# EasyEDA Pro project 主控板_V1.eprj

# Schematic 主控板
Create Date: 2023-10-18; Page Name: P1; Project Name: 主控板_V1. - 副本; Schematic Name: 主控板; Update Date: 2023-11-02; Company: 嘉立创EDA; Page Size: A4; Version: V1.0
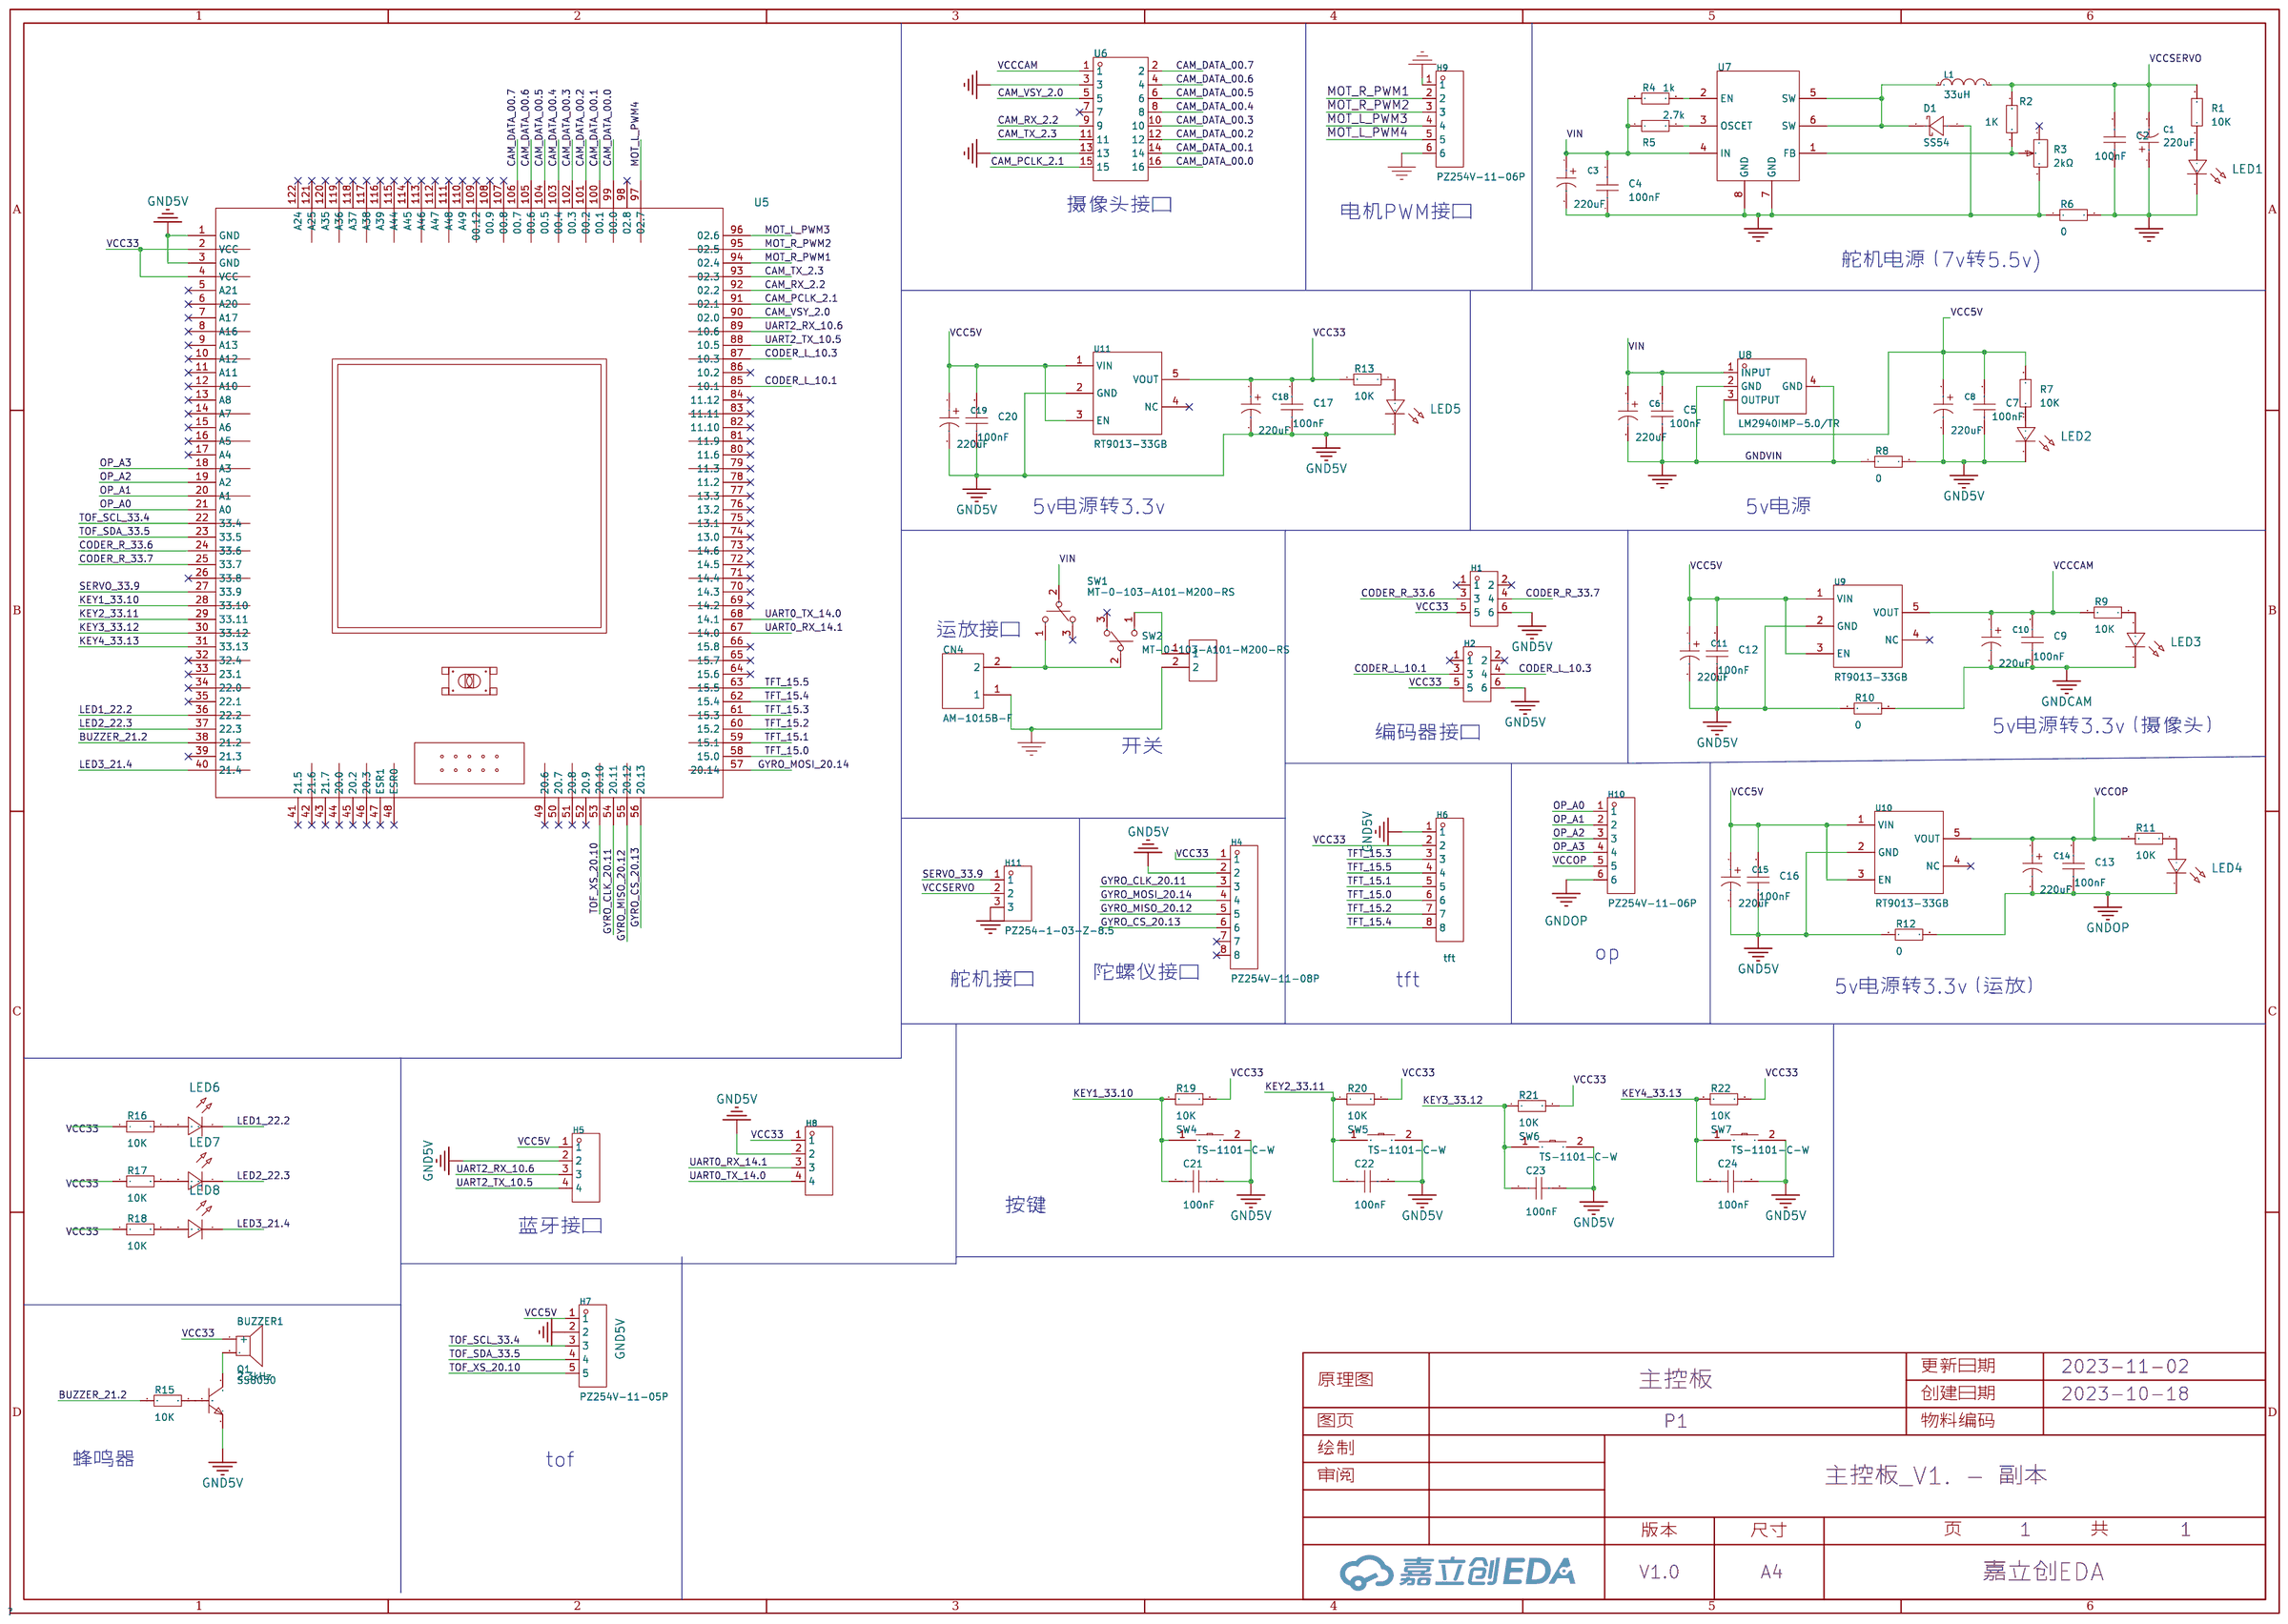
[diagram p0: schematic sheet]

## Parts
BUZZER1  2.3kHz  [BUZ-TH_BD12.0-P7.60-D0.6-FD]
C1  220uF  [CAP-SMD_BD6.3-L6.6-W6.6-FD]
C2  100nF  [C0603]
C3  220uF  [CAP-SMD_BD6.3-L6.6-W6.6-FD]
C4  100nF  [C0603]
C5  100nF  [C0603]
C6  220uF  [CAP-SMD_BD6.3-L6.6-W6.6-FD]
C7  100nF  [C0603]
C8  220uF  [CAP-SMD_BD6.3-L6.6-W6.6-FD]
C9  100nF  [C0603]
C10  220uF  [CAP-SMD_BD6.3-L6.6-W6.6-FD]
C11  220uF  [CAP-SMD_BD6.3-L6.6-W6.6-FD]
C12  100nF  [C0603]
C13  100nF  [C0603]
C14  220uF  [CAP-SMD_BD6.3-L6.6-W6.6-FD]
C15  220uF  [CAP-SMD_BD6.3-L6.6-W6.6-FD]
C16  100nF  [C0603]
C17  100nF  [C0603]
C18  220uF  [CAP-SMD_BD6.3-L6.6-W6.6-FD]
C19  220uF  [CAP-SMD_BD6.3-L6.6-W6.6-FD]
C20  100nF  [C0603]
C21  100nF  [C0603]
C22  100nF  [C0603]
C23  100nF  [C0603]
C24  100nF  [C0603]
CN4  AM-1015B-F  [CONN-TH_AM-1015B-F]
D1  SS54  [SMA_L4.3-W2.6-LS5.0-FD]
H1  PZ254V-12-6P  [HDR-TH_6P-P2.54-V-M-R2-C3-S2.54]
H2  PZ254V-12-6P  [HDR-TH_6P-P2.54-V-M-R2-C3-S2.54]
H4  PZ254V-11-08P  [HDR-TH_8P-P2.54-V-M]
H5  PZ254V-11-04P  [HDR-TH_4P-P2.54-V-M]
H6  tft  [HDR-TH_8P-P2.54-V-M]
H7  PZ254V-11-05P  [HDR-TH_5P-P2.54-V-M]
H8  PZ254V-11-04P  [HDR-TH_4P-P2.54-V-M]
H9  PZ254V-11-06P  [HDR-TH_6P-P2.54-V-M]
H10  PZ254V-11-06P  [HDR-TH_6P-P2.54-V-M]
H11  PZ254-1-03-Z-8.5  [HDR-TH_03P-P2.54-V-M]
L1  33uH  [IND-SMD_L7.0-W6.6_FXL0630]
LED1  -  [LED_0603]
LED2  -  [LED_0603]
LED3  -  [LED_0603]
LED4  -  [LED_0603]
LED5  -  [LED_0603]
LED6  -  [LED_0603]
LED7  -  [LED_0603]
LED8  -  [LED_0603]
P1  WJ500V-5.08-2P  [CONN-TH_2P-P5.00_WJ500V-5.08-2P]
Q1  SS8050  [SOT-23-3_L2.9-W1.3-P1.90-LS2.4-BR]
R1  10K  [R0603]
R2  1K  [R0603]
R3  2kΩ  [RES-ADJ-TH_3296W]
R4  1k  [R0603]
R5  2.7k  [R0603]
R6  0  [R0805]
R7  10K  [R0603]
R8  0  [R0805]
R9  10K  [R0603]
R10  0  [R0805]
R11  10K  [R0603]
R12  0  [R0805]
R13  10K  [R0603]
R15  10K  [R0603]
R16  10K  [R0603]
R17  10K  [R0603]
R18  10K  [R0603]
R19  10K  [R0603]
R20  10K  [R0603]
R21  10K  [R0603]
R22  10K  [R0603]
SW1  MT-0-103-A101-M200-RS  [SW-TH_MT-0-103-A101-M200-RS]
SW2  MT-0-103-A101-M200-RS  [SW-TH_MT-0-103-A101-M200-RS]
SW4  TS-1101-C-W  [SW-SMD_L6.0-W3.3-LS8.0]
SW5  TS-1101-C-W  [SW-SMD_L6.0-W3.3-LS8.0]
SW6  TS-1101-C-W  [SW-SMD_L6.0-W3.3-LS8.0]
SW7  TS-1101-C-W  [SW-SMD_L6.0-W3.3-LS8.0]
U5  TC264_CoreBoard  [TC264_main]
U6  PM254-2-08-Z-8.5  [HDR-TH_16P-P2.54-V-F-R2-C8-S2.54]
U7  -  [AS1015]
U8  LM2940IMP-5.0/TR  [SOT-223-3_L6.5-W3.4-P2.30-LS7.0-BR]
U9  RT9013-33GB  [SOT-23-5_L3.0-W1.7-P0.95-LS2.8-BL]
U10  RT9013-33GB  [SOT-23-5_L3.0-W1.7-P0.95-LS2.8-BL]
U11  RT9013-33GB  [SOT-23-5_L3.0-W1.7-P0.95-LS2.8-BL]

## Library data of the parts
BUZZER1 = TMB12A05_C96093: 驱动方式:有源(内含驱动线路);构造类型:电磁式;额定电压:5V;频率:2.3kHz;声压(SPL):85dB@5V,10cm;; LCSC Part Name: TMB12A05; Supplier Part: C96093; Manufacturer: 华能; Manufacturer Part: TMB12A05; Supplier Footprint: 插件,D=12mm; JLCPCB Part Class: Extended Part; Datasheet: https://atta.szlcsc.com/upload/public/pdf/source/20170522/1495448324811.pdf; Supplier: LCSC; Oscillator Circuit: 有源(内含驱动线路); Technology Type: 电磁式; Rated Voltage: 5V; Operating Voltage: 4V~8V; Sound Pressure Level (SPL): 85dB@5V,10cm; Diameter (φD): 12mm; Height: 9.8mm
C1 C3 C6 C8 C10 C11 C14 C15 C18 C19 = RVT220UF16V67RV0015: 容值:220uF;精度:±20%;额定电压:16V;纹波电流:110mA@120Hz;等效串联电阻:-;; LCSC Part Name: 220uF ±20% 16V; Supplier Part: C2887273; Manufacturer: KNSCHA(科尼盛); Supplier Footprint: SMD,D6.3xL7.7mm; JLCPCB Part Class: Extended Part; Datasheet: https://atta.szlcsc.com/upload/public/pdf/source/20210824/3DC9999D9B098FE241E3A26137981C4C.pdf; Supplier: LCSC; Tolerance: ±20%; Rated Voltage: 16V; φD: 6.3mm; L: 7.7mm; Ripple Current: 110mA@120Hz; Lifetime @ Temp: 2000hrs@105℃; Operating Temperature: -55℃~+105℃
C2 C4 C5 C7 C9 C12 C13 C16 C17 C20-C24 = CAP_0603: Supplier Footprint: 0603
CN4 = AM-1015B-F: 金属材质：铜镀金  绝缘材质：PA; LCSC Part Name: AMASS(艾迈斯) 防滑T插T型插头紫红大电流航空连接器AM-1015B-F; Supplier Part: C90630; Manufacturer: AMASS(艾迈斯); JLCPCB Part Class: Extended Part; Datasheet: https://atta.szlcsc.com/upload/public/pdf/source/20161217/1481939174479.pdf; Supplier: LCSC
D1 = SS54_C7420369: 二极管配置:独立式;直流反向耐压(Vr):40V;平均整流电流(Io):5A;正向压降(Vf):550mV@5.0A;; LCSC Part Name: 电压:40V 电流:5A; Supplier Part: C7420369; Manufacturer: 宏迦橙; Supplier Footprint: SMA; JLCPCB Part Class: Extended Part; Datasheet: https://atta.szlcsc.com/upload/public/pdf/source/20230828/254C3882F8647358AD9F60DD73611B5E.pdf; Supplier: LCSC; Diode Configuration: 独立式; Reverse Voltage (Vr): 40V; Average Rectified Current (Io): 5A; Forward Voltage (Vf@If): 550mV@5.0A; Reverse Leakage Current (Ir): 50uA@40V; Peak forward surge current: 120A
H1 H2 = PZ254V-12-6P: 排数:双排;总PIN位数:6P;间距:2.54mm;插针结构:2x3P;行距:2.54mm;安装类型:直插;圆针/方针:方针;额定电流:-;额定电压:-;配合针长度:6mm;塑高:2.5mm;端接针长度:3mm;触头材质:黄铜;触头镀层:-;工作温度范围:-40℃~+105℃;颜色:黑色;; LCSC Part Name: 2.54mm 2x3P 直插 方针; Supplier Part: C492420; Manufacturer: XFCN(兴飞); Supplier Footprint: 插件,P=2.54mm; JLCPCB Part Class: 扩展库; Datasheet: https://atta.szlcsc.com/upload/public/pdf/source/20200309/C492420_BAECB307B001054C09D200388220EAE6.pdf; Supplier: LCSC; Number of Rows: 双排; Number of Pins: 6P; Pitch: 2.54mm; Pin Structure: 2x3P; Row Spacing: 2.54mm; Mounting Type: 直插; Circluar Pins/Square Pins: 方针; Length of Mating Pin: 6mm; Insulation Height: 2.5mm; Length of End Connection Pin: 3mm; Contact Material: 黄铜; Operating Temperature Range: -40℃~+105℃; Color: 黑色
H4 H6 = PZ254V-11-08P: 排数:单排;总PIN位数:8P;间距:2.54mm;插针结构:1x8P;行距:-;安装类型:直插;圆针/方针:方针;额定电流:-;额定电压:-;配合针长度:6mm;塑高:2.5mm;端接针长度:3mm;触头材质:黄铜;触头镀层:-;工作温度范围:-40℃~+105℃;颜色:黑色;; LCSC Part Name: 2.54mm 1x8P 直插 方针; Supplier Part: C492407; Manufacturer: XFCN(兴飞); Supplier Footprint: 插件,P=2.54mm; JLCPCB Part Class: 扩展库; Datasheet: https://atta.szlcsc.com/upload/public/pdf/source/20200309/C492407_83A6FB26A2233368EDB9516968EC6149.pdf; Supplier: LCSC; Number of Rows: 单排; Number of Pins: 8P; Pitch: 2.54mm; Pin Structure: 1x8P; Mounting Type: 直插; Circluar Pins/Square Pins: 方针; Length of Mating Pin: 6mm; Insulation Height: 2.5mm; Length of End Connection Pin: 3mm; Contact Material: 黄铜; Operating Temperature Range: -40℃~+105℃; Color: 黑色
H5 H8 = PZ254V-11-04P: 排数:单排;总PIN位数:4P;间距:2.54mm;插针结构:1x4P;行距:-;安装类型:直插;圆针/方针:方针;额定电流:3A;额定电压:250V;配合针长度:6mm;塑高:2.5mm;端接针长度:3mm;触头材质:-;工作温度范围:-40℃~+105℃;颜色:黑色;; LCSC Part Name: 2.54mm 1x4P 直插 方针; Supplier Part: C2691448; Manufacturer: XFCN(兴飞); Supplier Footprint: 插件,P=2.54mm; JLCPCB Part Class: Extended Part; Datasheet: https://atta.szlcsc.com/upload/public/pdf/source/20200309/C492403_F9F19131791D08044AD4F84F8E751A34.pdf; Supplier: LCSC; Number of Rows: 单排; Number of Pins: 4P; Pitch: 2.54mm; Pin Structure: 1x4P; Mounting Type: 直插; Circluar Pins/Square Pins: 方针; Current Rating (Max): 3A; Voltage Rating (Max): 250V; Length of Mating Pin: 6mm; Insulation Height: 2.5mm; Length of End Connection Pin: 3mm; Operating Temperature Range: -40℃~+105℃; Color: 黑色
H7 = PZ254V-11-05P: 排数:单排;总PIN位数:5P;间距:2.54mm;插针结构:1x5P;行距:-;安装类型:直插;圆针/方针:方针;额定电流:-;额定电压:-;配合针长度:6mm;塑高:2.5mm;端接针长度:3mm;触头材质:黄铜;触头镀层:-;工作温度范围:-40℃~+105℃;颜色:黑色;; LCSC Part Name: 2.54mm 1x5P 直插 方针; Supplier Part: C492404; Manufacturer: XFCN(兴飞); Supplier Footprint: 插件,P=2.54mm; JLCPCB Part Class: 扩展库; Datasheet: https://atta.szlcsc.com/upload/public/pdf/source/20200309/C492404_E51533260F8710EFF5D4617281164C1D.pdf; Supplier: LCSC; Number of Rows: 单排; Number of Pins: 5P; Pitch: 2.54mm; Pin Structure: 1x5P; Mounting Type: 直插; Circluar Pins/Square Pins: 方针; Length of Mating Pin: 6mm; Insulation Height: 2.5mm; Length of End Connection Pin: 3mm; Contact Material: 黄铜; Operating Temperature Range: -40℃~+105℃; Color: 黑色
H9 H10 = PZ254V-11-06P: 排数:单排;总PIN位数:6;间距:2.54mm;插针结构:1x6P;行距:-;安装类型:直插;圆针/方针:方针;额定电流:-;额定电压:-;配合针长度:6mm;塑高:2.5mm;端接针长度:3mm;触头材质:黄铜;触头镀层:-;工作温度范围:-40℃~+105℃;颜色:黑色;; LCSC Part Name: 2.54mm 1x6P 直插 方针; Supplier Part: C492405; Manufacturer: XFCN(兴飞); Supplier Footprint: 直插,P=2.54mm; JLCPCB Part Class: 扩展库; Supplier: LCSC; Number of Rows: 单排; Number of Pins: 6; Pitch: 2.54mm; Pin Structure: 1x6P; Mounting Type: 直插; Circluar Pins/Square Pins: 方针; Length of Mating Pin: 6mm; Insulation Height: 2.5mm; Length of End Connection Pin: 3mm; Contact Material: 黄铜; Operating Temperature Range: -40℃~+105℃; Color: 黑色
H11 = PZ254-1-03-Z-8.5: 排数:单排;总PIN位数:3P;间距:2.54mm;插针结构:1x3P;行距:-;安装类型:直插;圆针/方针:方针;额定电流:3A;额定电压:-;配合针长度:6mm;塑高:2.5mm;端接针长度:3mm;触头材质:-;工作温度范围:-40℃~+105℃;颜色:黑色;; LCSC Part Name: 2.54mm 1x3P 直插 方针; Supplier Part: C2894926; Manufacturer: HCTL(华灿天禄); Supplier Footprint: 插件,P=2.54mm; JLCPCB Part Class: Extended Part; Datasheet: https://atta.szlcsc.com/upload/public/pdf/source/20230609/805D25CEF03592837AF6F506EEB5ED41.pdf; Supplier: LCSC; Number of Rows: 单排; Number of Pins: 3P; Pitch: 2.54mm; Pin Structure: 1x3P; Mounting Type: 直插; Circluar Pins/Square Pins: 方针; Current Rating (Max): 3A; Length of Mating Pin: 6mm; Insulation Height: 2.5mm; Length of End Connection Pin: 3mm; Operating Temperature Range: -40℃~+105℃; Color: 黑色
L1 = FXL0630-330-M: 类型:一体成型电感;电感值:33uH;精度:±20%;额定电流:2A;饱和电流(Isat):2.5A;; LCSC Part Name: 33uH ±20% 2.5A; Supplier Part: C177245; Manufacturer: cjiang(长江微电); Supplier Footprint: SMD,6.6x7mm; JLCPCB Part Class: 扩展库; Datasheet: https://atta.szlcsc.com/upload/public/pdf/source/20230516/3A080F5AF8C87BB81C3BA86E5F60E51A.pdf; Supplier: LCSC; Type: 一体成型电感; Tolerance: ±20%; Rated Current: 2A; Saturation Current (Isat): 2.5A; DC Resistance (DCR): 310mΩ
LED1-LED8 = LED_0603-R: Supplier Footprint: 0603
P1 = WJ500V-5.08-2P: 间距:5.08mm;结构:1x2P;排数:1;每排PIN数:2;安装方式:直针;额定电流:18A;额定电压:250V;线规 - AWG:14~30;线规 - mm2:2.5;工作温度范围:-40℃~+105℃;颜色:绿色;; LCSC Part Name: 5.08mm 1x2P 排数:1 每排P数:2 直针 可拼接; Supplier Part: C8465; Manufacturer: KANGNEX(康奈克斯电气); Supplier Footprint: 插件,P=5.08mm; JLCPCB Part Class: 扩展库; Datasheet: https://atta.szlcsc.com/upload/public/pdf/source/20191225/C8465_02D34CE5B5B4A53DF5891601D97FA9F4.pdf; Supplier: LCSC; Pitch: 5.08mm; Structure: 1x2P; Number of Rows: 1; Number of PINs Per Row: 2; Mounting Style: 直针; Current Rating (Max): 18A; Voltage Rating (Max): 250V; Wire Gauge - AWG: 14~30; Wire Gauge - mm2: 2.5; Operating Temperature Range: -40℃~+105℃; Color: 绿色
Q1 = SS8050_C2150: 晶体管类型:NPN;集射极击穿电压(Vceo):25V;集电极电流(Ic):1.5A;功率(Pd):300mW;直流电流增益(hFE@Ic,Vce):200@100mA,1V;; LCSC Part Name: NPN 25V 1.5A Y1 200-350; Supplier Part: C2150; Manufacturer: CJ(江苏长电/长晶); Supplier Footprint: SOT-23; JLCPCB Part Class: Basic Part; Datasheet: https://atta.szlcsc.com/upload/public/pdf/source/20230322/AEE86F4B043774EFF80CAEA14A37D9E9.pdf; Supplier: LCSC; Transistor Type: NPN; Collector-Emitter Breakdown Voltage (Vceo): 25V; Collector Current (Ic): 1.5A; Power Dissipation (Pd): 300mW; Collector Cut-Off Current (Icbo): 100nA; Collector-Emitter Saturation Voltage (VCE(sat)@Ic,Ib): 500mV@800mA,80mA; DC Current Gain (hFE@Ic,Vce): 200@100mA,1V; Transition Frequency (fT): 100MHz; Operating Temperature: +150℃@(Tj)
R1 R2 R4 R5 R7 R9 R11 R13 R15-R22 = Res_0603: Supplier Footprint: 0603
R3 = 3296W-1-102LF: 阻值:1kΩ;精度:±10%;功率:500mW;; LCSC Part Name: 1kΩ ±10%; Supplier Part: C57089; Manufacturer: BOURNS; Supplier Footprint: 插件; JLCPCB Part Class: 扩展库; Datasheet: https://atta.szlcsc.com/upload/public/pdf/source/20151026/1457707506403.pdf; Supplier: LCSC; Tolerance: ±10%; Power(Watts): 500mW; Temperature Coefficient: ±100ppm/℃; Turns: 25
R6 R8 R10 R12 = Res_0805: Supplier Footprint: 0805
SW1 SW2 = MT-0-103-A101-M200-RS: 额定电流:5A;额定电压(AC):125V;电路结构:单刀双掷;机械寿命:-;安装方式:直插;; LCSC Part Name: 小型钮子三脚三档 五件套 含配件; Supplier Part: C1788493; Manufacturer: YUEN FUNG(源丰); Supplier Footprint: 插件; JLCPCB Part Class: Extended Part; Datasheet: https://atta.szlcsc.com/upload/public/pdf/source/20230720/A7297B66510B798CA716A50870BE0E5B.pdf; Supplier: LCSC; Contact Current: 5A; Voltage Rating (AC): 125V; Circuit: 单刀双掷; Actuator Type: 圆柱钮柄; Pin Style: 焊片; Mounting Style: 直插; Operating Temperature: -25℃~+85℃; Switch Length: 13mm; Switch Width: 8mm; Switch Height: 28.6mm
SW4-SW7 = TS-1101-C-W: 触点电流:50mA;额定电压(AC):-;额定电压(DC):12V;额定功率:-;绝缘电阻:-;电路结构:单刀单掷;安装方式:立贴;带灯:无;作用力:260gf;机械寿命:5万次;带支架:否;; LCSC Part Name: 立贴 6*3.6*2.5mm 轻触开关 一型3*6*2.5有白ZD b拉伸白色带淡绿按键 卷装; Supplier Part: C318938; Manufacturer: XKB Connectivity(中国星坤); Supplier Footprint: SMD; JLCPCB Part Class: Extended Part; Datasheet: https://atta.szlcsc.com/upload/public/pdf/source/20200227/C318938_C2E53B1EEDE37D980A33616AC086DE53.pdf; Supplier: LCSC; Contact Current: 50mA; Voltage Rating (DC): 12V; Circuit: 单刀单掷; Mounting Style: 立贴; Actuator Style: 矩形按钮; Actuator/Cap Color: 白色带淡绿; With Lamp: 无; Operating Force: 260gf; Mechanical Life: 5万次; Operating Temperature: -30℃~+85℃; Switch Length: 6mm; Switch Width: 3.6mm; Switch Height: 2.5mm; Strike Gundam: 否
U5 = TC264_CoreBoard: TC264核心板
U6 = PM254-2-08-Z-8.5: 排数:双排;总孔位数:16P;间距:2.54mm;插孔结构:2x8P;行距:2.54mm;安装类型:直插;圆孔/方孔:方孔;额定电流:3A;额定电压:-;插孔方向:顶部;塑高:8.5mm;工作温度范围:-40℃~+105℃;; LCSC Part Name: 间距:2.54mm 2x8P 直插; Supplier Part: C2897409; Manufacturer: HCTL(华灿天禄); Supplier Footprint: 插件,P=2.54mm; JLCPCB Part Class: 扩展库; Datasheet: https://atta.szlcsc.com/upload/public/pdf/source/20230609/3D36CA2C1BFC9FD1C3F709AD9DFEB9C2.pdf; Supplier: LCSC; Number of Rows: 双排; Number of Holes: 16P; Pitch: 2.54mm; Holes Structure: 2x8P; Row Spacing: 2.54mm; Mounting Type: 直插; Circular Hole / Square Hole: 方孔; Current Rating (Max): 3A; Holes Direction: 顶部; Insulation Height: 8.5mm; Operating Temperature Range: -40℃~+105℃
U7 = aaa
U8 = LM2940IMP-5.0/TR: 输出类型:-;; Supplier Part: C565359; Manufacturer: HGSEMI(华冠); Supplier Footprint: SOT-223-3L; JLCPCB Part Class: 扩展库; Datasheet: https://atta.szlcsc.com/upload/public/pdf/source/20200910/C434496_FF12BC19E49A5882ABC2C07A121F415A.pdf; Supplier: LCSC
U9-U11 = RT9013-33GB: 输出类型:固定;输出极性:正;最大输入电压:5.5V;输出电压:3.3V;输出电流:500mA;电源纹波抑制比(PSRR):50dB@(10kHz);; LCSC Part Name: 输入5.5V 输出3.3V 500mA; Supplier Part: C47773; Manufacturer: RICHTEK(立锜); Supplier Footprint: SOT-23-5; JLCPCB Part Class: 扩展库; Datasheet: https://atta.szlcsc.com/upload/public/pdf/source/20150504/1457707282459.pdf; Supplier: LCSC; Output Type: 固定; Output Polarity: 正; Number of Outputs: 1; Maximum Input Voltage: 5.5V; Output Voltage: 3.3V; Dropout Voltage: 400mV@(500mA); Quiescent Current (Ground Current): 50uA; Output Current: 500mA; Power Supply Rejection Ratio (PSRR): 50dB@(10kHz); Operating Temperature: -40℃~+85℃

## Nets
GND5V: C7.1 C8.2 C11.2 C12.1 C15.2 C16.1 C17.1 C18.2 C19.2 C20.1 C21.2 C22.2 C23.2 C24.2 H1.6 H2.6 H4.2 H5.2 H6.1 H7.2 H8.2 LED2.1(C) LED5.1(C) Q1.2(E) R8.2 R10.1 R12.1 SW4.2 SW5.2 SW6.2 SW7.2 U5.1(GND) U5.3(GND) U9.2(GND) U10.2(GND) U11.2(GND)
GNDCAM: C9.1 C10.2 LED3.1(C) R10.2 U6.3 U6.13
GNDOP: C13.1 C14.2 H10.6 LED4.1(C) R12.2
GNDSERVO: C1.1 C2.1 H11.3 LED1.1(C) R6.2
GNDVIN: C3.2 C4.1 C5.1 C6.2 CN4.1 D1.1(A) H9.1 H9.6 P1.2 R3.3 R6.1 R8.1 U7.7(GND) U7.8(GND) U8.2(GND) U8.4(GND)
VCC5V: C7.2 C8.1 C11.1 C12.2 C15.1 C16.2 C19.1 C20.2 H5.1 H7.1 R7.2 U8.3(OUTPUT) U9.1(VIN) U9.3(EN) U10.1(VIN) U10.3(EN) U11.1(VIN) U11.3(EN)
VCC33: BUZZER1.1(+) C17.2 C18.1 H1.5 H2.5 H4.1 H6.2 H8.1 R13.2 R16.1 R17.1 R18.1 R19.2 R20.2 R21.2 R22.2 U5.2(VCC) U5.4(VCC) U11.5(VOUT)
VCCCAM: C9.2 C10.1 R9.2 U6.1 U9.5(VOUT)
VCCOP: C13.2 C14.1 H10.5 R11.2 U10.5(VOUT)
VCCSERVO: C1.2 C2.2 H11.2 L1.2 R1.2 R2.2
VIN: C3.1 C4.2 C5.2 C6.1 R4.1 R5.1 SW1.2 U7.4(IN) U8.1(INPUT)
BUZZER_21.2: R15.2 U5.38(21.2)
CAM_DATA_00.0: U5.99(00.0) U6.16
CAM_DATA_00.1: U5.100(00.1) U6.14
CAM_DATA_00.2: U5.101(00.2) U6.12
CAM_DATA_00.3: U5.102(00.3) U6.10
CAM_DATA_00.4: U5.103(00.4) U6.8
CAM_DATA_00.5: U5.104(00.5) U6.6
CAM_DATA_00.6: U5.105(00.6) U6.4
CAM_DATA_00.7: U5.106(00.7) U6.2
CAM_PCLK_2.1: U5.91(02.1) U6.15
CAM_RX_2.2: U5.92(02.2) U6.9
CAM_TX_2.3: U5.93(02.3) U6.11
CAM_VSY_2.0: U5.90(02.0) U6.5
CODER_L_10.1: H2.3 U5.85(10.1)
CODER_L_10.3: H2.4 U5.87(10.3)
CODER_R_33.6: H1.3 U5.24(33.6)
CODER_R_33.7: H1.4 U5.25(33.7)
GYRO_CLK_20.11: H4.3 U5.54(20.11)
GYRO_CS_20.13: H4.6 U5.56(20.13)
GYRO_MISO_20.12: H4.5 U5.55(20.12)
GYRO_MOSI_20.14: H4.4 U5.57(20.14)
KEY1_33.10: C21.1 R19.1 SW4.1 U5.28(33.10)
KEY2_33.11: C22.1 R20.1 SW5.1 U5.29(33.11)
KEY3_33.12: C23.1 R21.1 SW6.1 U5.30(33.12)
KEY4_33.13: C24.1 R22.1 SW7.1 U5.31(33.13)
LED1_22.2: LED6.1(C) U5.36(22.2)
LED2_22.3: LED7.1(C) U5.37(22.3)
LED3_21.4: LED8.1(C) U5.40(21.4)
MOT_L_PWM3: H9.4 U5.96(02.6)
MOT_L_PWM4: H9.5 U5.97(02.7)
MOT_R_PWM1: H9.2 U5.94(02.4)
MOT_R_PWM2: H9.3 U5.95(02.5)
OP_A0: H10.1 U5.21(A0)
OP_A1: H10.2 U5.20(A1)
OP_A2: H10.3 U5.19(A2)
OP_A3: H10.4 U5.18(A3)
SERVO_33.9: H11.1 U5.27(33.9)
TFT_15.0: H6.6 U5.58(15.0)
TFT_15.1: H6.5 U5.59(15.1)
TFT_15.2: H6.7 U5.60(15.2)
TFT_15.3: H6.3 U5.61(15.3)
TFT_15.4: H6.8 U5.62(15.4)
TFT_15.5: H6.4 U5.63(15.5)
TOF_SCL_33.4: H7.3 U5.22(33.4)
TOF_SDA_33.5: H7.4 U5.23(33.5)
TOF_XS_20.10: H7.5 U5.53(20.10)
UART0_RX_14.1: H8.3 U5.67(14.0)
UART0_TX_14.0: H8.4 U5.68(14.1)
UART2_RX_10.6: H5.3 U5.89(10.6)
UART2_TX_10.5: H5.4 U5.88(10.5)
$1N1136: D1.2(K) L1.1 U7.5(SW) U7.6(SW)
$1N1293: LED1.2(A) R1.1
$1N1648: R2.1 R3.2 U7.1(FB)
$1N1993: R4.2 U7.2(EN)
$1N1996: R5.2 U7.3(OSCET)
$1N2771: LED2.2(A) R7.1
$1N3451: LED3.2(A) R9.1
$1N4006: LED4.2(A) R11.1
$1N4319: LED5.2(A) R13.1
$1N4945: CN4.2 SW1.1 SW2.2
$1N4946: P1.1 SW2.1
$1N5921: BUZZER1.2 Q1.3(C)
$1N6046: Q1.1(B) R15.1
$1N7737: LED6.2(A) R16.2
$1N7792: LED7.2(A) R17.2
$1N7846: LED8.2(A) R18.2

Not connected (* = marked no-connect by the designer): H1 1* 2*; H2 1* 2*; H4 7* 8*; R3 1*; SW1 3*; SW2 3*; U5 5(A21)* 6(A20)* 7(A17)* 8(A16)* 9(A13)* 10(A12)* 11(A11)* 12(A10)* 13(A8)* 14(A7)* 15(A6)* 16(A5)* 17(A4)* 26(33.8)* 32(32.4)* 33(23.1)* 34(22.0)* 35(22.1)* 39(21.3)* 41(21.5)* 42(21.6)* 43(21.7)* 44(20.0)* 45(20.2)* 46(20.3)* 47(ESR1)* 48(ESR0)* 49(20.6)* 50(20.7)* 51(20.8)* 52(20.9)* 64(15.6)* 65(15.7)* 66(15.8)* 69(14.2)* 70(14.3)* 71(14.4)* 72(14.5)* 73(14.6)* 74(13.0)* 75(13.1)* 76(13.2)* 77(13.3)* 78(11.2)* 79(11.3)* 80(11.6)* 81(11.9)* 82(11.10)* 83(11.11)* 84(11.12)* 86(10.2)* 98(02.8)* 107(00.8)* 108(00.9)* 109(00.12)* 110(A49)* 111(A48)* 112(A47)* 113(A46)* 114(A45)* 115(A44)* 116(A39)* 117(A38)* 118(A37)* 119(A36)* 120(A35)* 121(A25)* 122(A24)*; U6 7*; U9 4(NC)*; U10 4(NC)*; U11 4(NC)*

## Notes on the sheet
- 摄像头接口
- 电机PWM接口
- 舵机电源（7v转5.5v)
- 5v电源转3.3v
- 5v电源
- 运放接口
- 编码器接口
- 5v电源转3.3v（摄像头）
- 开关
- op
- 陀螺仪接口
- 舵机接口
- tft
- 5v电源转3.3v（运放）
- 按键
- 蓝牙接口
- 蜂鸣器
- tof

# Board 主控板
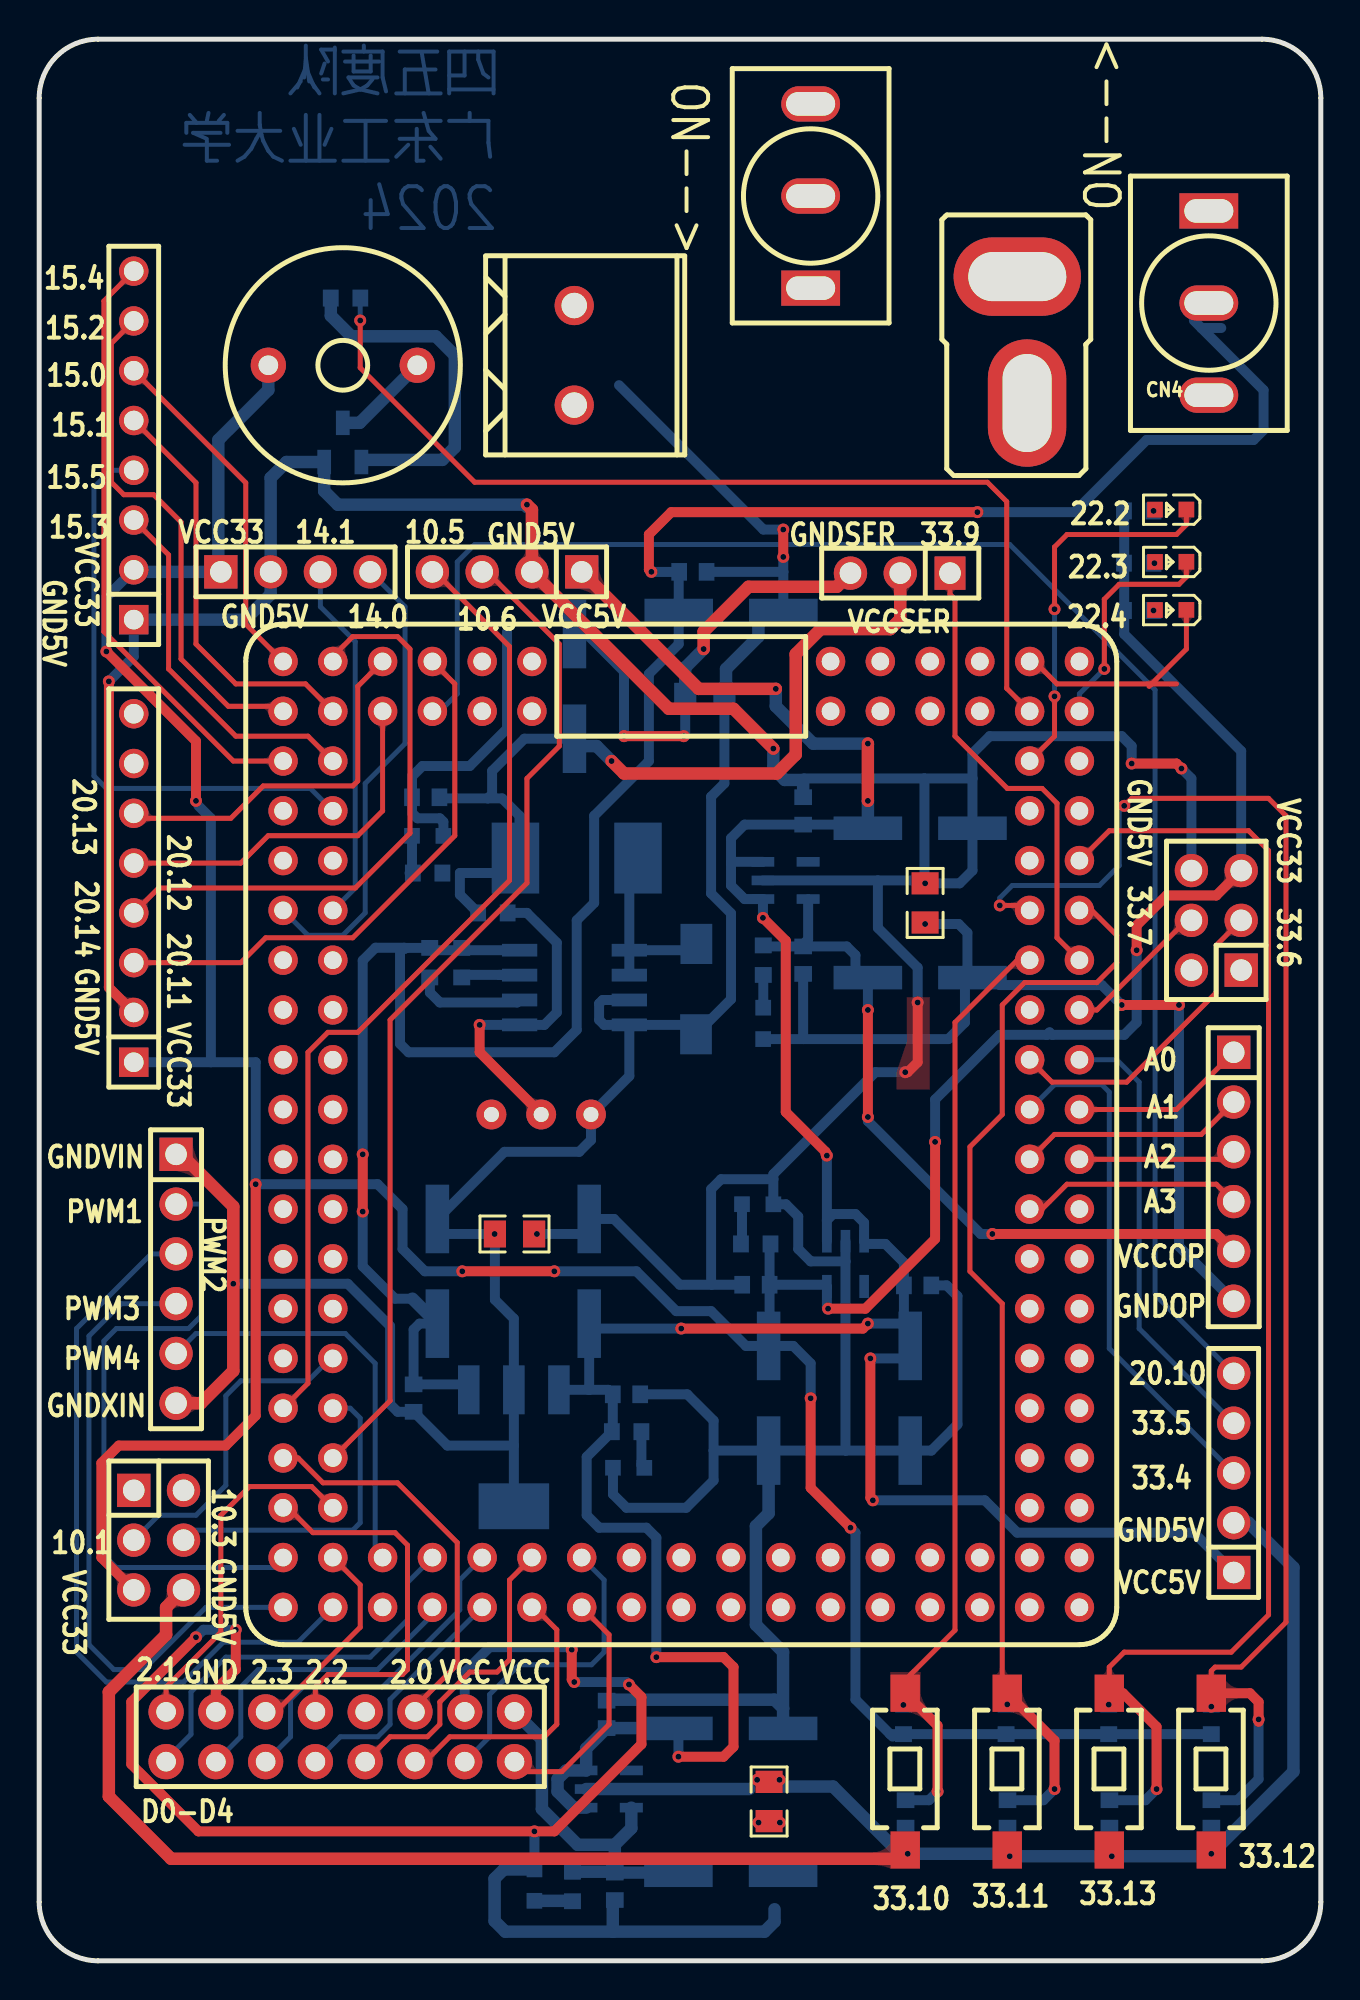
[diagram p1: board, top side]
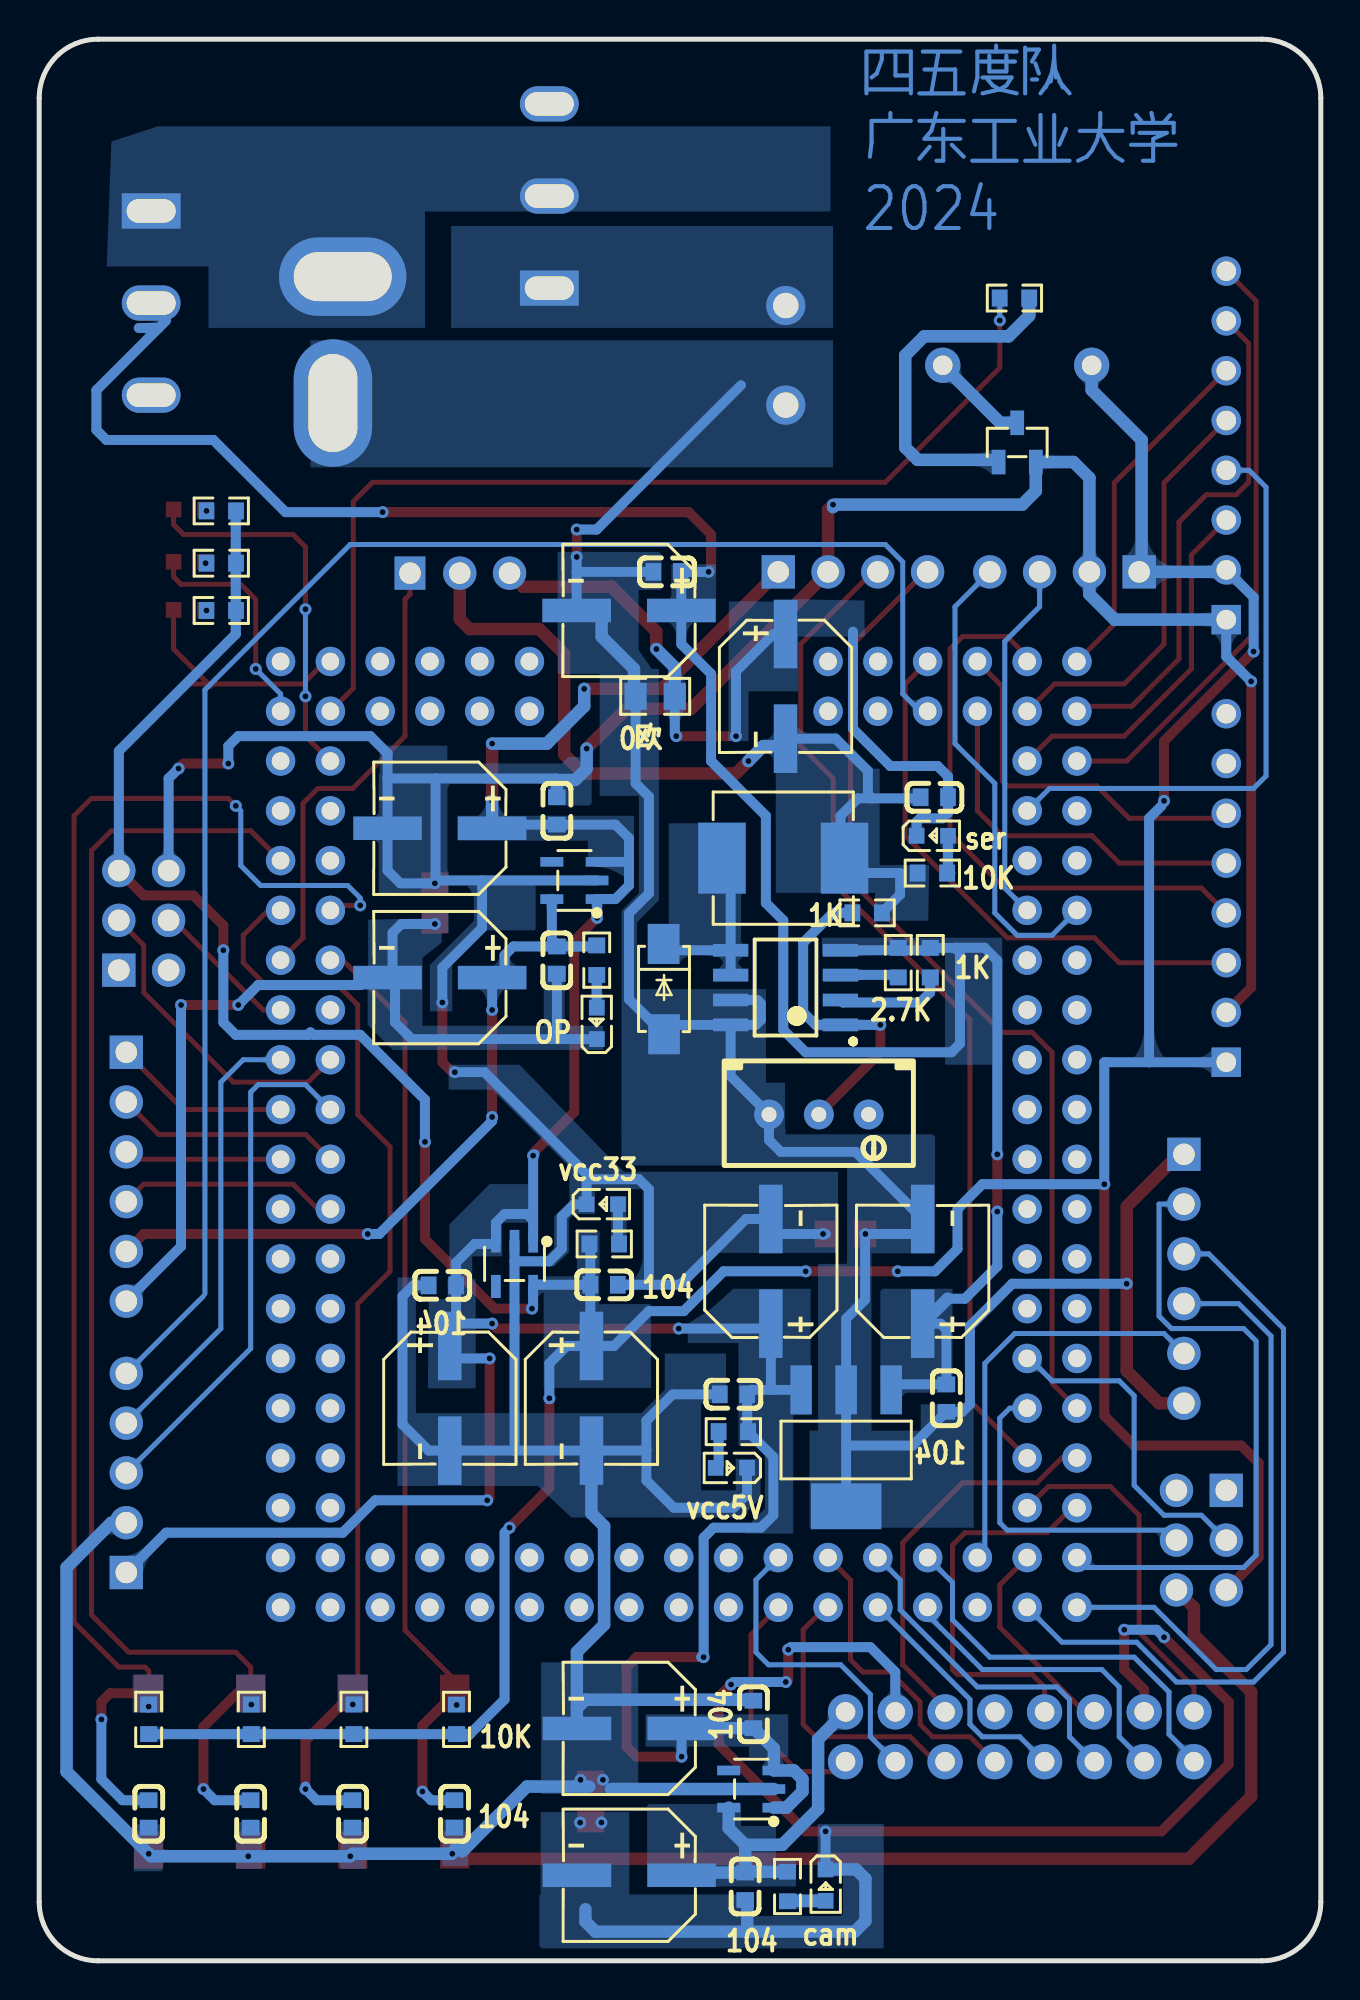
[diagram p2: board, bottom side, seen from below]

Outline 65.41 x 98.04 mm; copper layers: Top Layer, Bottom Layer. Coordinates in mm from the lower left corner of the outline.
Outline path: 0,95.04 0,3 arc(0.88,0.88) 3,0 62.41,0 arc(64.53,0.88) 65.41,3 65.41,95.04 arc(64.53,97.17) 62.41,98.04 3,98.04 arc(0.88,97.17) 0,95.04
Stack: Top Layer 0.035mm / Dielectric1 1.51mm FR4 er 4.5 / Bottom Layer 0.035mm

## Design rules (mm)
template: JLCPCB Capability(Two Layers Board)
spacing copperThickness1oz (default): track to track 0.102, other pairs 0.152 to 0.3
spacing copperThickness2oz: track to track 0.203, other pairs 0.152 to 0.3
track width copperThickness1oz (default): min 0.127, default 0.254, max 2.54
track width copperThickness2oz: min 0.203, default 0.254, max 2.54
differential pair differentialPair (default): width min 0.127, default 0.254, max 2.54; gap min 0.152, default 0.152
via viaSize (default): diameter min 0.5, default 0.61, max 10; hole min 0.3, default 0.305, max 6.3

## Placement (name value [footprint] x y rotation side)
BUZZER1  2.3kHz  [BUZ-TH_BD12.0-P7.60-D0.6-FD]  15.49 81.41 0 top
C1  220uF  [CAP-SMD_BD6.3-L6.6-W6.6-FD]  27.32 65.02 270 bottom
C2  100nF  [C0603]  19.73 59.37 0 bottom
C3  220uF  [CAP-SMD_BD6.3-L6.6-W6.6-FD]  35.31 68.9 0 bottom
C4  100nF  [C0603]  33.36 70.87 180 bottom
C5  100nF  [C0603]  19.11 28.71 90 bottom
C6  220uF  [CAP-SMD_BD6.3-L6.6-W6.6-FD]  20.32 35.18 90 bottom
C7  100nF  [C0603]  29.97 28.9 180 bottom
C8  220uF  [CAP-SMD_BD6.3-L6.6-W6.6-FD]  28.07 35.18 90 bottom
C9  100nF  [C0603]  29.38 3.8 90 bottom
C10  220uF  [CAP-SMD_BD6.3-L6.6-W6.6-FD]  35.29 4.36 0 bottom
C11  220uF  [CAP-SMD_BD6.3-L6.6-W6.6-FD]  35.29 11.86 0 bottom
C12  100nF  [C0603]  28.96 12.57 270 bottom
C13  100nF  [C0603]  38.99 51.05 90 bottom
C14  220uF  [CAP-SMD_BD6.3-L6.6-W6.6-FD]  44.96 50.17 0 bottom
C15  220uF  [CAP-SMD_BD6.3-L6.6-W6.6-FD]  44.96 57.79 0 bottom
C16  100nF  [C0603]  38.99 58.67 270 bottom
C17  100nF  [C0603]  36.58 34.49 0 bottom
C18  220uF  [CAP-SMD_BD6.3-L6.6-W6.6-FD]  37.22 28.7 270 bottom
C19  220uF  [CAP-SMD_BD6.3-L6.6-W6.6-FD]  44.45 28.7 270 bottom
C20  100nF  [C0603]  44.83 34.46 180 bottom
C21  100nF  [C0603]  44.21 7.49 270 bottom
C22  100nF  [C0603]  49.42 7.49 270 bottom
C23  100nF  [C0603]  59.82 7.49 270 bottom
C24  100nF  [C0603]  54.62 7.49 270 bottom
CN4  AM-1015B-F  [CONN-TH_AM-1015B-F]  50.17 82.71 180 top
D1  SS54  [SMA_L4.3-W2.6-LS5.0-FD]  33.53 49.58 90 bottom
H1  PZ254V-12-6P  [HDR-TH_6P-P2.54-V-M-R2-C3-S2.54]  60.07 53.09 90 top
H2  PZ254V-12-6P  [HDR-TH_6P-P2.54-V-M-R2-C3-S2.54]  6.1 21.46 270 top
H4  PZ254V-11-08P  [HDR-TH_8P-P2.54-V-M]  4.83 54.74 90 top
H5  PZ254V-11-04P  [HDR-TH_4P-P2.54-V-M]  23.88 70.87 180 top
H6  tft  [HDR-TH_8P-P2.54-V-M]  4.83 77.32 90 top
H7  PZ254V-11-05P  [HDR-TH_5P-P2.54-V-M]  60.96 24.89 90 top
H8  PZ254V-11-04P  [HDR-TH_4P-P2.54-V-M]  13.08 70.87 0 top
H9  PZ254V-11-06P  [HDR-TH_6P-P2.54-V-M]  6.99 34.8 270 top
H10  PZ254V-11-06P  [HDR-TH_6P-P2.54-V-M]  60.96 40.01 270 top
H11  PZ254-1-03-Z-8.5  [HDR-TH_03P-P2.54-V-M]  43.94 70.8 180 top
L1  33uH  [IND-SMD_L7.0-W6.6_FXL0630]  27.43 56.26 0 bottom
LED1  -  [LED_0603]  19.78 57.4 180 bottom
LED2  -  [LED_0603]  30.13 25.15 0 bottom
LED3  -  [LED_0603]  25.27 3.81 270 bottom
LED4  -  [LED_0603]  36.95 47.88 90 bottom
LED5  -  [LED_0603]  36.62 38.61 180 bottom
LED6  -  [LED_0603]  57.69 74.04 180 top
LED7  -  [LED_0603]  57.69 71.37 180 top
LED8  -  [LED_0603]  57.69 68.92 180 top
P1  WJ500V-5.08-2P  [CONN-TH_2P-P5.00_WJ500V-5.08-2P]  27.3 81.92 270 top
Q1  SS8050  [SOT-23-3_L2.9-W1.3-P1.90-LS2.4-BR]  15.49 77.47 270 bottom
R1  10K  [R0603]  19.82 55.5 0 bottom
R2  1K  [R0603]  23.15 53.47 180 bottom
R3  2kΩ  [RES-ADJ-TH_3296W]  25.62 43.18 270 bottom
R4  1k  [R0603]  19.93 50.93 270 bottom
R5  2.7k  [R0603]  21.56 50.93 270 bottom
R6  0  [R0805]  33.97 64.52 180 bottom
R7  10K  [R0603]  29.98 27 180 bottom
R8  0  [R0805]  24.26 37.08 0 top
R9  10K  [R0603]  27.22 3.79 90 bottom
R10  0  [R0805]  37.25 8.13 270 top
R11  10K  [R0603]  36.95 51.05 90 bottom
R12  0  [R0805]  45.21 53.98 270 top
R13  10K  [R0603]  36.57 36.58 0 bottom
R15  10K  [R0603]  15.64 84.84 0 bottom
R16  10K  [R0603]  56.11 73.98 0 bottom
R17  10K  [R0603]  56.11 71.31 0 bottom
R18  10K  [R0603]  56.11 68.9 0 bottom
R19  10K  [R0603]  44.11 12.32 270 bottom
R20  10K  [R0603]  49.34 12.32 270 bottom
R21  10K  [R0603]  59.82 12.32 270 bottom
R22  10K  [R0603]  54.58 12.32 270 bottom
SW1  MT-0-103-A101-M200-RS  [SW-TH_MT-0-103-A101-M200-RS]  59.69 84.58 270 top
SW2  MT-0-103-A101-M200-RS  [SW-TH_MT-0-103-A101-M200-RS]  39.37 90.04 90 top
SW4  TS-1101-C-W  [SW-SMD_L6.0-W3.3-LS8.0]  44.2 9.65 270 top
SW5  TS-1101-C-W  [SW-SMD_L6.0-W3.3-LS8.0]  49.4 9.65 270 top
SW6  TS-1101-C-W  [SW-SMD_L6.0-W3.3-LS8.0]  59.82 9.65 270 top
SW7  TS-1101-C-W  [SW-SMD_L6.0-W3.3-LS8.0]  54.61 9.65 270 top
U5  TC264_CoreBoard  [TC264_main]  53.09 18.03 180 top
U6  PM254-2-08-Z-8.5  [HDR-TH_16P-P2.54-V-F-R2-C8-S2.54]  15.37 11.43 180 top
U7  -  [AS1015]  27.32 49.66 0 bottom
U8  LM2940IMP-5.0/TR  [SOT-223-3_L6.5-W3.4-P2.30-LS7.0-BR]  24.22 26.16 90 bottom
U9  RT9013-33GB  [SOT-23-5_L3.0-W1.7-P0.95-LS2.8-BL]  29.07 8.76 90 bottom
U10  RT9013-33GB  [SOT-23-5_L3.0-W1.7-P0.95-LS2.8-BL]  38.09 55.12 90 bottom
U11  RT9013-33GB  [SOT-23-5_L3.0-W1.7-P0.95-LS2.8-BL]  41.15 35.56 0 bottom

## Footprints (pads in the part's own frame, mm; a bottom-side part is the same pattern mirrored in y, then rotated)
AS1015
  rect 1.8x0.65 smd: 1(-2.8,1.905) 2(-2.8,0.635) 3(-2.8,-0.635) 4(-2.8,-1.905) 5(2.8,-1.905) 6(2.8,-0.635) 7(2.8,0.635) 8(2.8,1.905)
BUZ-TH_BD12.0-P7.60-D0.6-FD
  round 1.8 hole 1: 1(-3.8,0) 2(3.8,0)
C0603
  rect 0.8x0.9 smd: 1(-0.7,0) 2(0.7,0)
CAP-SMD_BD6.3-L6.6-W6.6-FD
  rect 3.5x1.2 smd: 1(-2.67,0) 2(2.67,0)
CONN-TH_2P-P5.00_WJ500V-5.08-2P
  round 2 hole 1.3: 1(-2.54,0) 2(2.54,0)
CONN-TH_AM-1015B-F
  oval 4x6.5 hole 2.5x5: 1(-0.25,3.224)
  oval 6.5x4 hole 5x2.5: 2(0.25,-3.224)
HDR-TH_03P-P2.54-V-M
  rect 1.575x1.7 hole 1.1: 1(-2.54,0)
  round 1.7 hole 1.1: 2(0,0) 3(2.54,0)
HDR-TH_4P-P2.54-V-M
  rect 1.7x1.7 hole 1.1: 1(-3.81,0)
  round 1.7 hole 1.1: 2(-1.27,0) 3(1.27,0) 4(3.81,0)
HDR-TH_5P-P2.54-V-M
  rect 1.7x1.7 hole 1.1: 1(-5.08,0)
  round 1.7 hole 1.1: 2(-2.54,0) 3(0,0) 4(2.54,0) 5(5.08,0)
HDR-TH_6P-P2.54-V-M
  rect 1.7x1.7 hole 1.1: 1(-6.35,0)
  round 1.7 hole 1.1: 2(-3.81,0) 3(-1.27,0) 4(1.27,0) 5(3.81,0) 6(6.35,0)
HDR-TH_6P-P2.54-V-M-R2-C3-S2.54
  rect 1.7x1.7 hole 1.1: 1(-2.54,-1.27)
  round 1.7 hole 1.1: 2(-2.54,1.27) 3(0,-1.27) 4(0,1.27) 5(2.54,-1.27) 6(2.54,1.27)
HDR-TH_8P-P2.54-V-M
  rect 1.5x1.5 hole 1: 1(-8.89,0)
  round 1.5 hole 1: 2(-6.35,0) 3(-3.81,0) 4(-1.27,0) 5(1.27,0) 6(3.81,0) 7(6.35,0) 8(8.89,0)
HDR-TH_16P-P2.54-V-F-R2-C8-S2.54
  round 1.8 hole 1: 1(-8.89,-1.27) 2(-8.89,1.27) 3(-6.35,-1.27) 4(-6.35,1.27) 5(-3.81,-1.27) 6(-3.81,1.27) 7(-1.27,-1.27) 8(-1.27,1.27) 9(1.27,-1.27) 10(1.27,1.27) 11(3.81,-1.27) 12(3.81,1.27) 13(6.35,-1.27) 14(6.35,1.27) 15(8.89,-1.27) 16(8.89,1.27)
IND-SMD_L7.0-W6.6_FXL0630
  rect 2.424x3.62 smd: 1(3.128,0) 2(-3.128,0)
LED_0603
  rect 0.8x0.8 smd: 1(-0.851,-0.01) 2(0.75,-0.005)
R0603
  rect 0.806x0.864 smd: 1(-0.753,0) 2(0.753,0)
R0805
  rect 1.133x1.377 smd: 1(-1,0) 2(1,0)
RES-ADJ-TH_3296W
  round 1.524 hole 0.762: 1(0,2.54) 2(0,0) 3(0,-2.54)
SMA_L4.3-W2.6-LS5.0-FD
  rect 2.046x1.62 smd: 1(-2.304,-0.009) 2(2.304,0.009)
SOT-23-3_L2.9-W1.3-P1.90-LS2.4-BR
  rect 1.25x0.7 smd: 1(1,-0.95) 2(1,0.95) 3(-1,0)
SOT-23-5_L3.0-W1.7-P0.95-LS2.8-BL
  rect 0.49x1.157 smd: 1(-0.95,-1.153) 2(0,-1.153) 3(0.95,-1.153)
  rect 0.49x1.175 smd: 4(0.95,1.153) 5(-0.95,1.153)
SOT-223-3_L6.5-W3.4-P2.30-LS7.0-BR
  rect 2.5x1.1 smd: 1(2.97,-2.3) 2(2.97,0) 3(2.97,2.3)
  rect 2.34x3.6 smd: 4(-2.97,0)
SW-SMD_L6.0-W3.3-LS8.0
  rect 1.9x1.5 smd: 1(-4,0) 2(4,0)
SW-TH_MT-0-103-A101-M200-RS
  rect 1.8x3 hole 1.2x2.5: 1(-4.7,0)
  oval 1.8x3 hole 1.2x2.5: 2(0,0) 3(4.7,0)
TC264_main
  round 1.5 hole 0.9: 1(0,0) 2(2.54,0) 3(0,-2.54) 4(2.54,-2.54) 5(0,-5.08) 6(2.54,-5.08) 7(0,-7.62) 8(2.54,-7.62) 9(0,-10.16) 10(2.54,-10.16) 11(0,-12.7) 12(2.54,-12.7) 13(0,-15.24) 14(2.54,-15.24) 15(0,-17.78) 16(2.54,-17.78) 17(0,-20.32) 18(2.54,-20.32) 19(0,-22.86) 20(2.54,-22.86) 21(0,-25.4) 22(2.54,-25.4) 23(0,-27.94) 24(2.54,-27.94) 25(0,-30.48) 26(2.54,-30.48) 27(0,-33.02) 28(2.54,-33.02) 29(0,-35.56) 30(2.54,-35.56) 31(0,-38.1) 32(2.54,-38.1) 33(0,-40.64) 34(2.54,-40.64) 35(0,-43.18) 36(2.54,-43.18) 37(0,-45.72) 38(2.54,-45.72) 39(0,-48.26) 40(2.54,-48.26) 41(5.08,-48.26) 42(5.08,-45.72) 43(7.62,-48.26) 44(7.62,-45.72) 45(10.16,-48.26) 46(10.16,-45.72) 47(12.7,-48.26) 48(12.7,-45.72) 49(27.94,-45.72) 50(27.94,-48.26) 51(30.48,-45.72) 52(30.48,-48.26) 53(33.02,-45.72) 54(33.02,-48.26) 55(35.56,-45.72) 56(35.56,-48.26) 57(38.1,-48.26) 58(40.64,-48.26) 59(38.1,-45.72) 60(40.64,-45.72) 61(38.1,-43.18) 62(40.64,-43.18) 63(38.1,-40.64) 64(40.64,-40.64) 65(38.1,-38.1) 66(40.64,-38.1) 67(38.1,-35.56) 68(40.64,-35.56) 69(38.1,-33.02) 70(40.64,-33.02) 71(38.1,-30.48) 72(40.64,-30.48) 73(38.1,-27.94) 74(40.64,-27.94) 75(38.1,-25.4) 76(40.64,-25.4) 77(38.1,-22.86) 78(40.64,-22.86) 79(38.1,-20.32) 80(40.64,-20.32) 81(38.1,-17.78) 82(40.64,-17.78) 83(38.1,-15.24) 84(40.64,-15.24) 85(38.1,-12.7) 86(40.64,-12.7) 87(38.1,-10.16) 88(40.64,-10.16) 89(38.1,-7.62) 90(40.64,-7.62) 91(38.1,-5.08) 92(40.64,-5.08) 93(38.1,-2.54) 94(40.64,-2.54) 95(38.1,0) 96(40.64,0) 97(35.56,-2.54) 98(35.56,0) 99(33.02,-2.54) 100(33.02,0) 101(30.48,-2.54) 102(30.48,0) 103(27.94,-2.54) 104(27.94,0) 105(25.4,-2.54) 106(25.4,0) 107(22.86,-2.54) 108(22.86,0) 109(20.32,-2.54) 110(20.32,0) 111(17.78,-2.54) 112(17.78,0) 113(15.24,-2.54) 114(15.24,0) 115(12.7,-2.54) 116(12.7,0) 117(10.16,-2.54) 118(10.16,0) 119(7.62,-2.54) 120(7.62,0) 121(5.08,-2.54) 122(5.08,0)

## Nets
As in the schematic.

Pads without a net: H1 1 2; H2 1 2; H4 7 8; R3 1; SW1 3; SW2 3; U5 5 6 7 8 9 10 11 12 13 14 15 16 17 26 32 33 34 35 39 41 42 43 44 45 46 47 48 49 50 51 52 64 65 66 69 70 71 72 73 74 75 76 77 78 79 80 81 82 83 84 86 98 107 108 109 110 111 112 113 114 115 116 117 118 119 120 121 122; U6 7; U9 4; U10 4; U11 4

## Via types
v1: diameter 0.61, hole 0.305, Top Layer to Bottom Layer, 80 vias

## Routing (per net, layer and track width the routed paths; a pad name or vN(x,y) marks a point on that pad's centre or on a via; arc(x,y) is an arc through that point)
GND5V: length 347.9
  Top Layer w0.508: v1(44.2,45.34) 44.32,45.34 44.83,45.85 v1(44.83,48.9) ; v1(3.56,65.28) 3.56,49.66 H4.2 ; v1(55.75,61.09) 58.04,61.09 v1(58.29,60.83)
  Top Layer w0.635: v1(37.47,61.85) 35.43,63.88 32.13,63.88 H5.2 25.15,74.04 v1(24.89,74.3) ; 7.37,18.92 6.48,18.03 6.48,16.64 3.56,13.72 3.56,8.38 6.73,5.21 44.07,5.21 v1(44.32,5.46)
  Bottom Layer w0.508: 34.42,26.03 34.42,24.51 33.02,23.11 29.97,23.11 29.28,23.8 LED2.1 ; 34.42,26.03 C18.2 41.17,26.03 ; 34.42,26.03 34.42,27.56 33.07,28.9 C7.1 ; v1(58.29,60.83) 58.8,60.33 H1.6 ; 42.8,55.12 42.8,52.7 44.83,50.67 v1(44.83,48.9) ; 42.8,55.12 36.94,55.12 ; 42.8,55.12 45.18,55.12 45.18,60.33 ; 34.32,34.49 34.29,34.53 34.29,39.37 34.8,39.88 37.47,39.88 ; 34.32,34.49 C17.1 ; 34.32,34.49 32.69,34.49 29.33,37.85 C8.2 28.07,37.29 27.86,37.08 R8.2 ; v1(3.56,65.28) 4.83,66.55 H6.1 ; C20.1 46.31,34.46 46.86,33.91 46.86,27.37 45.53,26.03 C19.2 41.17,26.03 ; 41.15,35.69 U11.2 ; 41.15,35.69 41.15,26.05 41.17,26.03 ; 41.15,35.69 39.37,35.69 38.73,36.32 38.73,37.97 38.11,38.6 LED5.1 37.47,39.88 ; 37.47,39.88 37.47,40.13 42.67,45.34 v1(44.2,45.34) ; v1(45.21,54.98) 46.97,54.98 47.63,55.63 C15.2 47.63,60.33 47.63,60.33 ; 47.63,60.33 47.63,61.6 48.51,62.48 55.25,62.48 55.75,61.98 v1(55.75,61.09) ; 47.63,60.33 45.18,60.33 ; 45.18,60.33 39.06,60.33 38.99,60.25
  Bottom Layer w0.635: 43.69,5.72 44.13,5.72 SW4.2 ; 43.69,5.72 40.51,8.89 37.34,8.89 ; 43.69,5.72 43.75,5.65 ; 37.96,12.88 37.96,15.76 36.58,17.15 36.58,22.18 37.22,22.83 C18.2 ; 37.96,12.88 C11.2 ; 37.96,12.88 37.52,13.32 29.01,13.32 28.96,13.27 ; 24.89,74.17 24.77,74.3 15.24,74.3 14.54,74.99 Q1.2 12.62,76.47 11.81,75.66 H8.2 11.81,69.72 10.52,68.43 H6.1 ; 43.75,5.65 SW4.2 ; 43.75,5.65 43.82,5.59 ; SW4.2 44.39,5.46 49.4,5.46 v1(49.53,5.33) v1(54.74,5.33) 59.69,5.33 v1(59.82,5.46) 64.01,9.65 64.01,20.07 61.72,22.35 H7.2 ; U9.2 36.23,8.76 ; C16.1 38.99,60.25 38.05,60.25 37.47,60.83 v1(37.47,61.85)
  vias: v1(25.4,37.08) v1(36.64,9.23) v1(37.78,9.23)
GNDCAM: length 83.2
  Top Layer w0.508: v1(8,16.51) 4.7,13.21 4.7,10.03 8.13,6.6 v1(25.27,6.6) 26.29,6.6 30.73,11.05 30.73,13.46 v1(30.1,14.1) ; v1(27.18,15.88) 27.18,14.35 v1(27.3,14.22) ; U6.13 9.02,13.84 10.03,14.86 v1(10.03,16.89)
  Bottom Layer w0.508: v1(27.3,14.22) 29.97,14.22 v1(30.1,14.1) ; U6.3 21.72,14.73 22.99,16 27.05,16 v1(27.18,15.88) ; v1(25.27,6.6) 25.28,6.6 LED3.1 ; v1(10.03,16.89) 8.38,16.89 v1(8,16.51)
  Bottom Layer w0.635: C9.1 29.27,3 29.27,1.49 ; LED3.1 23.71,4.66 23.24,4.19 23.24,2.03 23.79,1.49 29.27,1.49 ; 29.27,1.49 37.02,1.49 37.53,2 37.53,2.63
  vias: v1(36.71,7.05) v1(37.8,7.05)
GNDOP: length 48.5
  Top Layer w0.508: v1(55.25,48.77) v1(58.17,48.77)
  Bottom Layer w0.508: C14.2 47.37,50.42 47.37,52.45 46.92,52.9 v1(45.21,52.9) ; C14.2 48.64,50.17 49.02,49.78 54.23,49.78 v1(55.25,48.77) ; C14.2 47.24,49.78 47.24,47.88 46.39,47.03 38.99,47.03 ; v1(58.17,48.77) 58.17,36.45 H10.6 ; 38.99,47.03 LED4.1 ; 38.99,47.03 C13.1
GNDSERVO: length 39.3
  Top Layer w0.508: v1(29.85,62.48) v1(32.89,62.48)
  Top Layer w0.635: H11.3 40.7,70.1 36.2,70.1 33.91,67.82 v1(33.91,66.93)
  Bottom Layer w0.508: C1.1 27.94,67.69 29.85,65.79 v1(29.85,62.48) ; 23.88,67.82 23.88,62.87 21.97,60.96 19.56,60.96 19.03,60.43 C2.1 19.03,58.57 19.3,58.29 20.45,58.29 20.63,58.11 LED1.1 ; v1(32.89,62.48) 32.97,62.56 R6.2
  Bottom Layer w0.635: R6.2 32.97,65.99 v1(33.91,66.93)
GNDVIN: length 122.4
  Top Layer w0.508: v1(37.97,73.03) v1(37.97,71.63)
  Top Layer w0.635: H9.6 8.26,28.45 9.91,30.1 v1(9.91,34.54) 9.91,38.48 7.24,41.15 H9.1
  Bottom Layer w0.508: U7.8 30.12,45.14 R3.3 28.16,41.87 27.56,41.28 23.75,41.28 C6.2 20.32,37.08 R8.1 23.26,33.73 24.22,32.76 U8.2 24.22,26.29 ; U7.8 33.04,47.75 D1.1 35.31,49.06 35.31,53.44 34.29,54.46 34.29,59.4 34.97,60.08 R6.1 ; U7.8 28.83,47.75 28.58,48.01 28.58,48.84 28.76,49.02 U7.7 ; 37.98,70.87 37.97,70.87 v1(37.97,71.63) ; 37.98,70.87 C3.2 ; 37.98,70.87 C4.1 ; 24.22,26.29 U8.4 ; 24.22,26.29 20.83,26.29 C5.1 18.3,28.01 17.91,28.4 17.91,32.39 15.75,34.54 v1(9.91,34.54) ; v1(37.97,73.03) 36.96,73.03 29.59,80.39
  Bottom Layer w0.635: R6.1 35.05,64.6 35.05,65.91 36.7,67.56 36.7,68.64 36.96,68.9 C3.2
  vias: v1(23.24,37.08)
VCC5V: length 157.5
  Top Layer w0.508: v1(42.42,30.73) 42.42,23.62 v1(42.55,23.5) ; v1(42.29,32.51) 42.04,32.26 v1(32.77,32.26) ; v1(31.5,15.49) 34.92,15.49 35.43,14.99 35.43,10.92 34.92,10.41 v1(32.62,10.41) ; v1(36.94,53.21) 38.1,52.05 38.1,43.31 40.13,41.28 40.13,41.15
  Top Layer w0.635: v1(42.29,59.18) v1(42.29,62.1) ; v1(37.59,64.9) 33.66,64.9 H5.1
  Bottom Layer w0.508: 28.07,29.13 29.04,29.13 C7.2 29.27,27.04 R7.2 27.94,25.71 27.94,22.73 28.58,22.1 30.99,22.1 31.5,21.59 31.5,15.62 31.62,15.49 ; 28.07,29.13 C8.1 28.32,32.26 v1(32.77,32.26) ; 28.07,29.13 U8.3 ; 40.2,37.79 40.51,38.1 41.66,38.1 42.1,37.66 U11.3 42.24,36.58 43.18,36.58 44.13,35.63 C20.2 44.13,32.51 ; 40.2,37.79 v1(40.2,41.08) 40.13,41.15 ; 40.2,37.79 U11.1 ; 35.31,56.01 35.31,57.28 36,57.97 C16.2 42.1,57.97 C15.1 ; 35.31,56.01 35.31,54.86 36,54.17 36.94,54.17 v1(36.94,53.21) ; 35.31,56.01 35.37,56.07 36.94,56.07 ; 44.13,32.51 v1(42.29,32.51) ; 44.13,32.51 44.13,32.26 44.45,31.94 C19.1 44.45,30.73 v1(42.42,30.73) ; v1(42.55,23.5) 48.26,23.5 49.91,21.84 58.93,21.84 H7.1 ; C11.1 v1(32.62,10.41)
  Bottom Layer w0.635: v1(42.29,62.1) 39.5,62.1 37.59,64.01 v1(37.59,64.9) ; v1(42.29,59.18) 42.29,57.79 C15.1 ; U9.1 27.28,7.81 26.45,8.64 26.45,9.27 26.9,9.71 27.91,9.71 27.91,10.83 C12.2 32.61,11.87 C11.1
VCC33: length 222.2
  Top Layer w0.508: v1(40.26,33.27) 42.16,33.27 45.72,36.83 v1(45.72,41.78) ; v1(8,59.18) 8,62.23 v1(3.43,66.8) ; v1(39.37,28.7) 39.37,24.13 v1(41.4,22.1) ; v1(26.29,35.18) v1(21.59,35.18) ; 4.83,18.92 3.18,20.57 3.18,25.4 4.06,26.29 9.53,26.29 11.05,27.81 v1(11.05,39.62) ; v1(56.01,51.56) 56.01,52.83 57.53,54.36 60.07,54.36 61.34,55.63
  Bottom Layer w0.508: R16.1 55.37,73.96 55.37,67.69 61.34,61.72 61.34,55.63 ; 8.13,58.93 8.76,58.29 8.76,45.85 ; C18.1 36.07,31.37 34.29,33.15 32.51,33.15 30.48,35.18 v1(26.29,35.18) ; C18.1 38.48,31.37 39.37,30.48 v1(39.37,28.7) ; C18.1 37.28,31.42 C17.2 ; v1(45.72,41.78) 45.72,43.94 49.02,47.24 51.44,47.24 51.56,47.37 51.69,47.24 55.37,47.24 56.01,47.88 v1(56.01,51.56) ; C17.2 37.28,36.53 R13.2 ; C17.2 40.11,34.49 U11.5 40.2,33.34 v1(40.26,33.27) ; 8.76,45.85 11.05,45.85 v1(11.05,39.62) 17.27,39.62 18.54,38.35 18.54,36.32 19.69,35.18 v1(21.59,35.18) ; 8.76,45.85 H4.1 ; H6.2 3.43,69.57 v1(3.43,66.8) ; R21.2 R22.2 R20.2 R19.2 43.43,11.57 ; 43.43,11.57 41.66,13.34 41.66,21.84 v1(41.4,22.1) ; 43.43,11.57 43.55,11.44
  Bottom Layer w0.635: H6.2 4.93,70.87 H8.1 9.14,70.99 9.14,77.6 11.69,80.15 BUZZER1.1
VCCCAM: length 19.2
  Bottom Layer w0.635: 29.38,5.92 C9.2 ; 29.38,5.92 27.48,5.92 25.65,7.75 25.65,11.3 U6.1 ; 29.38,5.92 30.22,6.76 U9.5 ; C9.2 29.33,4.55 R9.2 ; C9.2 32.49,4.5 C10.1
VCCOP: length 38.1
  Top Layer w0.508: H10.5 60.07,37.08 v1(48.64,37.08) ; v1(42.29,48.51) v1(42.29,43.05)
  Bottom Layer w0.508: U10.5 39.24,52.11 38.88,51.75 ; 36.95,51.93 37.13,51.75 38.88,51.75 ; 38.88,51.75 41.21,51.75 41.66,51.31 41.66,50.17 C14.1 42.29,50.16 v1(42.29,48.51) ; v1(48.64,37.08) 48.05,37.08 42.29,42.84 v1(42.29,43.05)
VCCSERVO: length 44.6
  Top Layer w0.635: H11.2 43.94,68.45 43.43,67.95 39.88,67.95 38.61,66.68 38.61,61.54 37.64,60.58 29.85,60.58 v1(29.21,61.21)
  Bottom Layer w0.508: R2.2 21.47,54.4 21.47,55.5 23.55,55.5 L1.2 24.51,56.47 24.51,58.42 23.62,59.31 22.9,59.31 ; 22.9,59.31 23.11,59.53 23.11,60.71 24.76,62.35 C1.2 ; 22.9,59.31 20.48,59.31 C2.2
  Bottom Layer w0.635: v1(29.21,61.21) 28.45,61.98 27.7,61.98 C1.2
VIN: length 121.4
  Top Layer w0.508: v1(16.51,38.23) v1(16.51,41.15) ; v1(47.88,73.91) 32.26,73.91 31.11,72.77 31.11,70.99 v1(31.24,70.87)
  Bottom Layer w0.508: 18.67,51.64 18.42,51.64 18.42,46.79 18.85,46.36 26.29,46.36 27.43,47.5 27.43,53.09 28.32,53.98 28.32,58.42 31.11,61.21 31.11,65.66 32.64,67.18 C3.1 32.64,70.86 ; 18.67,51.64 18.62,51.69 17.16,51.69 16.51,51.04 v1(16.51,41.15) ; 18.67,51.64 18.71,51.68 R4.1 ; C4.2 32.64,70.87 32.64,70.86 ; 59.31,83.31 58.93,83.69 ; 59.31,83.31 62.48,80.14 62.48,78.11 61.98,77.6 56.52,77.6 52.83,73.91 v1(47.88,73.91) ; 59.31,83.31 60.33,83.31 ; C6.1 19.41,32.51 19.11,32.21 C5.2 21.64,29.41 U8.1 ; U7.4 20.18,51.56 19.93,51.81 ; v1(31.24,70.87) 31.25,70.86 32.64,70.86 ; v1(16.51,38.23) 16.51,35.43 18.16,33.78 19.05,33.78
  Bottom Layer w0.635: C6.1 19.05,33.78
BUZZER_21.2: length 50.6
  Top Layer w0.254: U5.38 49.38,64.92 49.38,74.45 48.39,75.44 22.23,75.44 16.38,81.28 v1(16.38,83.69)
  Bottom Layer w0.254: v1(16.38,83.69) 16.38,84.83 R15.2
CAM_DATA_00.0: length 20.4
  Bottom Layer w0.254: U6.16 6.48,10.29 7.75,11.56 7.75,13.72 9.53,15.49 16.89,15.49 18.8,17.4 18.8,19.3 U5.99
CAM_DATA_00.1: length 16
  Bottom Layer w0.254: U6.14 10.29,11.43 10.29,13.97 11.18,14.86 17.27,14.86 20.07,17.65 U5.100
CAM_DATA_00.2: length 17.4
  Bottom Layer w0.254: U5.101 21.46,19.43 21.46,17.91 17.53,13.97 13.46,13.97 12.83,13.34 12.83,11.43 U6.12
CAM_DATA_00.3: length 12.5
  Bottom Layer w0.254: U6.10 15.37,11.43 17.27,11.43 17.91,12.07 17.91,13.34 U5.102
CAM_DATA_00.4: length 15.9
  Top Layer w0.254: U6.8 17.91,11.43 19.81,11.43 20.45,12.07 20.45,13.21 21.97,14.73 23.37,14.73 24,15.37 24,19.43 U5.103
CAM_DATA_00.5: length 14.6
  Top Layer w0.254: U6.6 19.69,10.16 20.95,11.43 25.78,11.43 26.42,12.07 26.42,16.89 25.27,18.03 U5.104
CAM_DATA_00.6: length 16
  Bottom Layer w0.254: U5.105 28.83,19.43 28.83,15.75 28.19,15.1 24.5,15.1 22.99,13.59 22.99,11.43 U6.4
CAM_DATA_00.7: length 12.6
  Top Layer w0.254: U6.2 24.76,9.65 26.67,9.65 29.08,12.07 29.08,16.64 U5.106
CAM_PCLK_2.1: length 18
  Top Layer w0.254: U5.91 13.9,24.2 10.73,24.2 9.27,22.73 9.27,16.76 6.48,13.97 U6.15
CAM_RX_2.2: length 19.8
  Top Layer w0.254: U6.9 14.1,13.97 14.73,14.61 18.54,14.61 18.8,14.86 18.8,21.21 18.16,21.84 13.97,21.84 12.7,23.11 U5.92
CAM_TX_2.3: length 10.8
  Top Layer w0.254: U5.93 16.38,19.18 16.38,17.02 12.07,12.7 U6.11
CAM_VSY_2.0: length 20.2
  Top Layer w0.254: U6.5 19.18,12.95 21.34,15.11 21.34,21.34 18.28,24.39 14.48,24.39 13.22,25.65 U5.90
CODER_L_10.1: length 16.7
  Bottom Layer w0.254: U5.85 14.86,30.73 13.72,29.59 10.29,29.59 9.53,28.83 9.53,24.26 8,22.73 6.1,22.73 H2.3
CODER_L_10.3: length 16.4
  Bottom Layer w0.254: U5.87 15.88,28.19 16.38,27.69 16.38,22.35 16,21.97 7.75,21.97 7.37,21.59 H2.4
CODER_R_33.6: length 16.1
  Top Layer w0.254: U5.24 51.69,44.83 55.5,44.83 60.07,49.4 60.07,51.82 61.34,53.09
CODER_R_33.7: length 7.6
  Top Layer w0.254: H1.4 58.55,53.09 53.98,48.51 U5.25
GYRO_CLK_20.11: length 28.4
  Top Layer w0.254: U5.54 21.21,65.15 21.21,57.4 16,52.2 11.56,52.2 10.29,50.93 H4.3
GYRO_CS_20.13: length 18.9
  Top Layer w0.254: H4.6 5.08,58.29 9.78,58.29 11.43,59.94 16,59.94 16.26,60.2 16.26,65.02 U5.56
GYRO_MISO_20.12: length 18.9
  Top Layer w0.254: H4.5 10.29,56.01 11.68,57.4 16.26,57.4 17.53,58.67 U5.55
GYRO_MOSI_20.14: length 30.1
  Top Layer w0.254: U5.57 14.99,66.55 16,67.56 18.29,67.56 18.92,66.93 18.92,57.53 16.13,54.74 6.1,54.74 H4.4
KEY1_33.10: length 47.4
  Top Layer w0.254: U5.28 49.91,51.05 46.74,47.88 46.74,16.87 44.09,14.22
  Top Layer w0.508: SW4.1 45.85,12 v1(45.85,8.64)
  Bottom Layer w0.508: C21.1 45.4,8.19 v1(45.85,8.64)
  vias: v1(44.1,13.05)
KEY2_33.11: length 56
  Top Layer w0.254: SW5.1 49.15,13.65 49.15,33.53 47.5,35.18 47.5,41.53 49.15,43.18 49.15,48.77 50.29,49.91 53.98,49.91 54.99,50.93 54.99,52.32 53.72,53.59 U5.29
  Top Layer w0.508: SW5.1 51.82,11.24 v1(51.82,8.76)
  Bottom Layer w0.508: 51.82,8.89 v1(51.82,8.76) 51.25,8.19 C22.1
  vias: v1(49.4,13.08)
KEY3_33.12: length 77.2
  Top Layer w0.254: v1(55.37,58.93) 55.75,59.31 62.74,59.31 63.63,58.42 63.63,17.27 61.34,14.99 60.01,14.99 59.82,14.79 SW6.1 ; v1(49.02,53.85) 50.29,53.85 U5.30
  Top Layer w0.508: 62.23,12.19 62.23,13.21 61.79,13.65 SW6.1
  Bottom Layer w0.254: v1(49.02,53.85) 49.02,54.23 49.66,54.86 54.1,54.86 55.12,55.88 55.12,58.67 v1(55.37,58.93)
  Bottom Layer w0.508: C23.1 61.15,8.19 62.23,9.27 62.23,12.19
  vias: v1(59.82,12.97) v1(62.23,12.32)
KEY4_33.13: length 69.1
  Top Layer w0.254: SW7.1 54.61,14.99 55.37,15.75 60.83,15.75 62.74,17.65 62.74,56.64 61.72,57.66 54.61,57.66 U5.31
  Top Layer w0.508: 57.02,8.89 57.02,11.94 55.31,13.65 SW7.1
  Bottom Layer w0.508: C24.1 56.45,8.19 v1(57.02,8.76)
  vias: v1(54.58,13.07)
LED1_22.2: length 19.4
  Top Layer w0.254: U5.36 51.82,62.48 v1(51.82,64.52) ; LED6.1 58.55,73.28 58.04,72.77 52.45,72.77 51.82,72.14 v1(51.82,68.96)
  Bottom Layer w0.254: v1(51.82,68.96) v1(51.82,64.52)
LED2_22.3: length 11.7
  Top Layer w0.254: v1(54.36,65.91) 54.36,69.47 55.12,70.23 58.17,70.23 58.55,70.61 LED7.1
  Bottom Layer w0.254: v1(54.36,65.91) 53.09,64.64 U5.37
LED3_21.4: length 12.7
  Top Layer w0.254: LED8.1 58.55,66.93 56.77,65.15 ; 56.77,65.15 56.64,65.02 ; 56.77,65.15 51.94,65.15 50.8,66.29 U5.40 ; 56.77,65.15 58.04,65.15
MOT_L_PWM3: length 32.6
  Bottom Layer w0.254: H9.4 4.19,33.53 2.54,31.88 2.54,16.13 3.81,14.86 5.33,14.86 8.51,18.03 U5.96
MOT_L_PWM4: length 21.3
  Bottom Layer w0.254: H9.5 8,32 15.62,32 17.14,30.48 17.14,20.96 U5.97
MOT_R_PWM1: length 33
  Bottom Layer w0.254: U5.94 11.94,20.07 3.94,20.07 3.3,20.7 3.3,31.62 3.94,32.26 7.62,32.26 8.26,32.89 8.26,38.61 H9.2
MOT_R_PWM2: length 38.5
  Bottom Layer w0.254: U5.95 13.21,16.26 9.4,16.26 7.37,14.22 3.43,14.22 1.91,15.75 1.91,32.26 5.72,36.07 H9.3
OP_A0: length 9.1
  Top Layer w0.254: U5.21 58.04,43.43 H10.1
OP_A1: length 11.6
  Top Layer w0.254: U5.20 51.82,42.16 59.31,42.16 H10.2
OP_A2: length 8
  Top Layer w0.254: H10.3 60.58,40.89 U5.19
OP_A3: length 11.3
  Top Layer w0.254: H10.4 60.07,39.62 52.45,39.62 51.18,38.35 U5.18
SERVO_33.9: length 23.5
  Top Layer w0.254: H11.1 46.48,69.72 46.74,69.47 46.74,62.48 49.4,59.82 51.18,59.82 51.94,59.06 51.94,52.2 U5.27
TFT_15.0: length 18
  Top Layer w0.254: U5.58 10.54,68.2 10.54,75.41 H6.6
TFT_15.1: length 21.1
  Top Layer w0.254: H6.5 8,75.41 8,67.18 10.03,65.15 13.59,65.15 U5.59
TFT_15.2: length 26.4
  Top Layer w0.254: H6.7 3.68,82.53 3.68,75.44 4.32,74.8 5.84,74.8 7.24,73.41 7.24,66.42 9.65,64.01 12.19,64.01 U5.60
TFT_15.3: length 18.7
  Top Layer w0.254: H6.3 6.6,71.73 6.6,65.91 10.03,62.48 13.72,62.48 U5.61
TFT_15.4: length 30.9
  Top Layer w0.254: U5.62 9.91,61.21 3.3,67.82 3.3,84.69 H6.8
TFT_15.5: length 30.1
  Bottom Layer w0.254: U5.63 13.84,59.82 3.43,59.82 2.79,60.45 2.79,75.18 3.66,76.05 H6.4
TOF_SCL_33.4: length 26.8
  Bottom Layer w0.254: H7.3 54.61,31.24 54.61,44.32 54.23,44.7 51.82,44.7 U5.22
TOF_SDA_33.5: length 22.9
  Bottom Layer w0.254: U5.23 54.99,45.97 56.13,44.83 56.13,32.26 H7.4
TOF_XS_20.10: length 83.8
  Bottom Layer w0.254: 56.95,34.04 56.95,64.85 49.53,72.26 22.23,72.26 21.34,71.37 21.34,64.64 20.45,63.75 U5.53 ; H7.5 57.02,33.91
UART0_RX_14.1: length 18.5
  Bottom Layer w0.254: H8.3 14.35,69.09 16.13,67.31 16.13,54.74 U5.67
UART0_TX_14.0: length 24.2
  Bottom Layer w0.254: H8.4 18.67,69.09 18.67,62.1 16.64,60.07 16.64,53.47 15.49,52.32 13.72,52.32 U5.68
UART2_RX_10.6: length 51.8
  Top Layer w0.254: H5.3 22.86,70.87 26.54,67.18 26.54,61.98 24.89,60.33 24.89,54.99 17.91,48.01 17.91,28.58 U5.89
UART2_TX_10.5: length 49.9
  Top Layer w0.254: 20.32,70.87 20.26,70.8 24,67.06 24,55.12 16.26,47.37 14.73,47.37 13.72,46.36 13.72,29.46 U5.88
$1N1136: length 9.7
  Bottom Layer w0.508: U7.5 U7.6 ; U7.5 30.12,55.82 L1.1 ; U7.5 33.22,51.56 D1.2
$1N1293: length 2
  Bottom Layer w0.508: LED1.2 19.03,55.62 18.9,55.5
$1N1648: length 16.8
  Top Layer w0.508: R3.2 25.62,43.22 22.48,46.36 v1(22.48,47.75)
  Bottom Layer w0.508: v1(22.48,47.75) U7.1 25.78,47.75 26.42,48.39 26.42,51.94 24.89,53.47 R2.1
$1N1993: length 5.6
  Bottom Layer w0.508: R4.2 19.94,50.16 19.94,49.4 20.45,48.9 24.39,48.9 U7.2
$1N1996: length 3.2
  Bottom Layer w0.508: 23.47,50.3 23.71,50.3 23.72,50.29 ; 23.47,50.3 21.55,50.3 ; 23.47,50.3 23.72,50.29 ; 23.72,50.29 U7.3
$1N2771: length 1.9
  Bottom Layer w0.508: LED2.2 30.73,25.3 R7.1
$1N3451: length 2
  Bottom Layer w0.635: R9.1 27.19,3.06 LED3.2
$1N4006: length 1.7
  Bottom Layer w0.508: R11.1 36.95,48.63 LED4.2
$1N4319: length 2
  Bottom Layer w0.508: R13.1 35.87,36.63 35.87,38.6
$1N5921: length 5
  Bottom Layer w0.635: Q1.3 16.36,78.47 BUZZER1.2
$1N6046: length 17.8
  Bottom Layer w0.635: Q1.1 16.55,76.58 20.57,76.58 21.21,77.22 21.21,81.92 20.24,82.88 15.93,82.88 14.88,83.93 R15.1
$1N7737:
  vias: v1(56.87,73.98)
$1N7792:
  vias: v1(56.91,71.31)
$1N7846:
  vias: v1(56.87,68.9)

## Copper pours and planes (outline as drawn; the poured copper is in the pictures)
GND5V on Top Layer: 43.75,49.17 45.45,49.17 45.45,44.45 43.75,44.45
GND5V on Top Layer: 24.18,74.3 24.18,4.75 24.82,4.11 59.48,4.11 63.88,8.51 63.88,72.64 27.81,72.64 26.04,74.42 24.64,74.42 24.51,74.55 24.26,74.3
GND5V on Bottom Layer: 24.69,37.98 26.02,37.98 26.02,36.17 24.69,36.17
GND5V on Bottom Layer: 44.52,55.63 45.95,55.63 45.95,54.41 44.52,54.41
GND5V on Bottom Layer: 44.58,62 48.07,62 48.07,54.41 44.58,54.41
GND5V on Bottom Layer: 40.07,55.37 45.47,55.37 45.47,48.44 40.07,48.44
GND5V on Bottom Layer: 24.64,45.72 44.51,45.72 44.51,34.49 24.64,34.49
GND5V on Bottom Layer: 28.59,34.87 47.12,34.87 47.12,22.61 28.59,22.61
GND5V on Bottom Layer: 59.11,6.96 60.58,6.96 60.58,4.57 59.11,4.57
GND5V on Bottom Layer: 34.83,15.23 39.79,15.23 39.79,8.51 34.83,8.51
GND5V on Bottom Layer: 54.04,7.09 55.37,7.09 55.37,4.7 54.04,4.7
GND5V on Bottom Layer: 37.21,61.42 45.18,61.42 45.18,58.95 37.21,58.95
GND5V on Bottom Layer: 43.5,7.21 44.83,7.21 44.83,4.83 43.5,4.83
GND5V on Bottom Layer: 38.23,19.81 37.86,19.44 0.9,19.44 0.13,18.67 0.13,1.02 0.25,0.89 65.41,0.89 66.29,1.78 66.29,72.52 62.99,75.82 38.61,75.82 38.23,76.2
GND5V on Bottom Layer: 48.71,7.09 50.04,7.09 50.04,4.7 48.71,4.7
GNDCAM on Bottom Layer: 22.31,7.58 39.88,7.58 39.88,0.64 22.31,0.64
GNDOP on Bottom Layer: 36.63,53.47 48.64,53.47 48.64,46.48 36.63,46.48
GNDOP on Bottom Layer: 44.51,53.54 45.85,53.54 45.85,52.45 44.51,52.45
GNDOP on Bottom Layer: 38.59,50.74 39.62,50.74 39.62,47.63 38.59,47.63
GNDSERVO on Bottom Layer: 23.28,69.47 30.23,69.47 30.23,62.23 23.28,62.23
GNDVIN on Top Layer: 65.17,74.93 65.17,97.64 64.39,98.43 0.64,98.43 0.25,98.81 0.25,6.73 25.65,6.73 25.78,6.86 25.78,34.8 22.99,37.59 22.99,66.55 23.37,66.93 23.37,74.68 63.75,74.68 65.02,75.95 65.02,75.08
GNDVIN on Bottom Layer: 17.65,42.63 35.69,42.63 35.69,22.1 17.65,22.1
GNDVIN on Bottom Layer: 64.9,99.95 64.52,100.33 1.52,100.33 0.38,99.19 0.38,17.77 1.91,16.24 25.13,16.24 25.27,16.38 25.27,39.78 24.47,40.58 35.99,40.58 37.59,42.18 37.59,75.64 38.15,76.2 64.9,76.2
GNDVIN on Bottom Layer: 24.89,82.68 51.56,82.68 51.56,76.2 24.89,76.2
GNDVIN on Bottom Layer: 64.9,76.71 64.9,90.17 64.77,90.3 64.77,76.84
GNDVIN on Bottom Layer: 27.34,71.88 38.95,71.88 38.95,42.16 27.34,42.16
VCC5V on Bottom Layer: 40.2,39.62 44.48,39.62 44.48,34.06 40.2,34.06
VCC5V on Bottom Layer: 35.05,58.42 44.07,58.42 44.07,55.88 35.05,55.88
VCC5V on Bottom Layer: 26.04,34.29 32.31,34.29 32.31,21.79 26.04,21.79
VCC5V on Bottom Layer: 27.18,12.57 34.46,12.57 34.46,10.4 27.18,10.4
VCC5V on Bottom Layer: 43.13,34.77 45.57,34.77 45.57,29.21 43.13,29.21
VCC33 on Bottom Layer: 34.18,37.24 39.66,37.24 39.66,29.24 34.18,29.24
VCCCAM on Bottom Layer: 26.79,8 34.38,8 34.38,3.79 26.79,3.79
VCCSERVO on Bottom Layer: 19.98,62.66 27.81,62.66 27.81,53.07 19.98,53.07
VIN on Bottom Layer: 18.8,34.29 22.48,34.29 22.48,28.99 18.8,28.99
VIN on Bottom Layer: 16.26,52.2 25.46,52.2 25.46,45.72 16.26,45.72
VIN on Bottom Layer: 30.86,71.25 33.15,71.25 33.15,68.33 30.86,68.33
KEY1_33.10 on Top Layer: 43.43,14.73 44.99,14.73 44.99,12.75 43.43,12.75
KEY2_33.11 on Bottom Layer: 48.64,14.61 50.19,14.61 50.19,12.75 48.64,12.75
KEY3_33.12 on Bottom Layer: 59.05,14.61 60.64,14.61 60.64,12.65 59.05,12.65
KEY4_33.13 on Bottom Layer: 53.85,14.61 55.35,14.61 55.35,12.65 53.85,12.65
$1N1136 on Bottom Layer: 29.59,58.04 33.27,58.04 33.27,51.56 29.59,51.56
$1N4319 on Bottom Layer: 35.43,38.99 36.32,38.99 36.32,36.18 35.43,36.18
$1N4945 on Bottom Layer: 25.02,93.6 61.96,93.6 61.96,83.31 25.02,83.31
$1N4946 on Bottom Layer: 24.89,88.52 44.39,88.52 44.39,83.31 24.89,83.31

Small or netless copper shapes (teardrops, artwork), in the pictures only: 88 on Top Layer, 243 on Bottom Layer

## Text on the board
Bottom Layer: 四五度队 / 广东工业大学 / 2024
Bottom Silkscreen Layer: 104 | ser | 10K | 1K | 2.7K | cam | vcc5V | vcc33 | OP | 0欧
Top Silkscreen Layer: 33.10 | 33.11 | 33.13 | GNDOP | VCCOP | GND5V | VCC5V | 20.10 | 33.5 | 33.4 | A0 | A2 | A3 | A1 | 33.12 | 33.7 | VCC33 | 33.6 | 15.4 | 15.2 | 15.0 | 15.5 | 15.3 | 15.1 | 14.1 | 14.0 | 10.5 | 10.6 | GNDSER | VCCSER | 33.9 | 22.4 | 22.3 | 22.2 | 20.13 | 20.14 | 20.12 | 20.11 | GNDVIN | PWM1 | PWM2 | GNDXIN | PWM3 | PWM4 | 10.1 | 10.3 | 2.1 | D0-D4 | GND | 2.3 | 2.2 | 2.0 | VCC | ON-->
